# EAGLE board BSC_mini (EAGLE 7.7.0), part 1 of 3
DRAWING_NUMBER: V002; DRAWN: Mario Blunk / Blunk electronic; PROJECT: M-1; STATUS: DEVELOPMENT
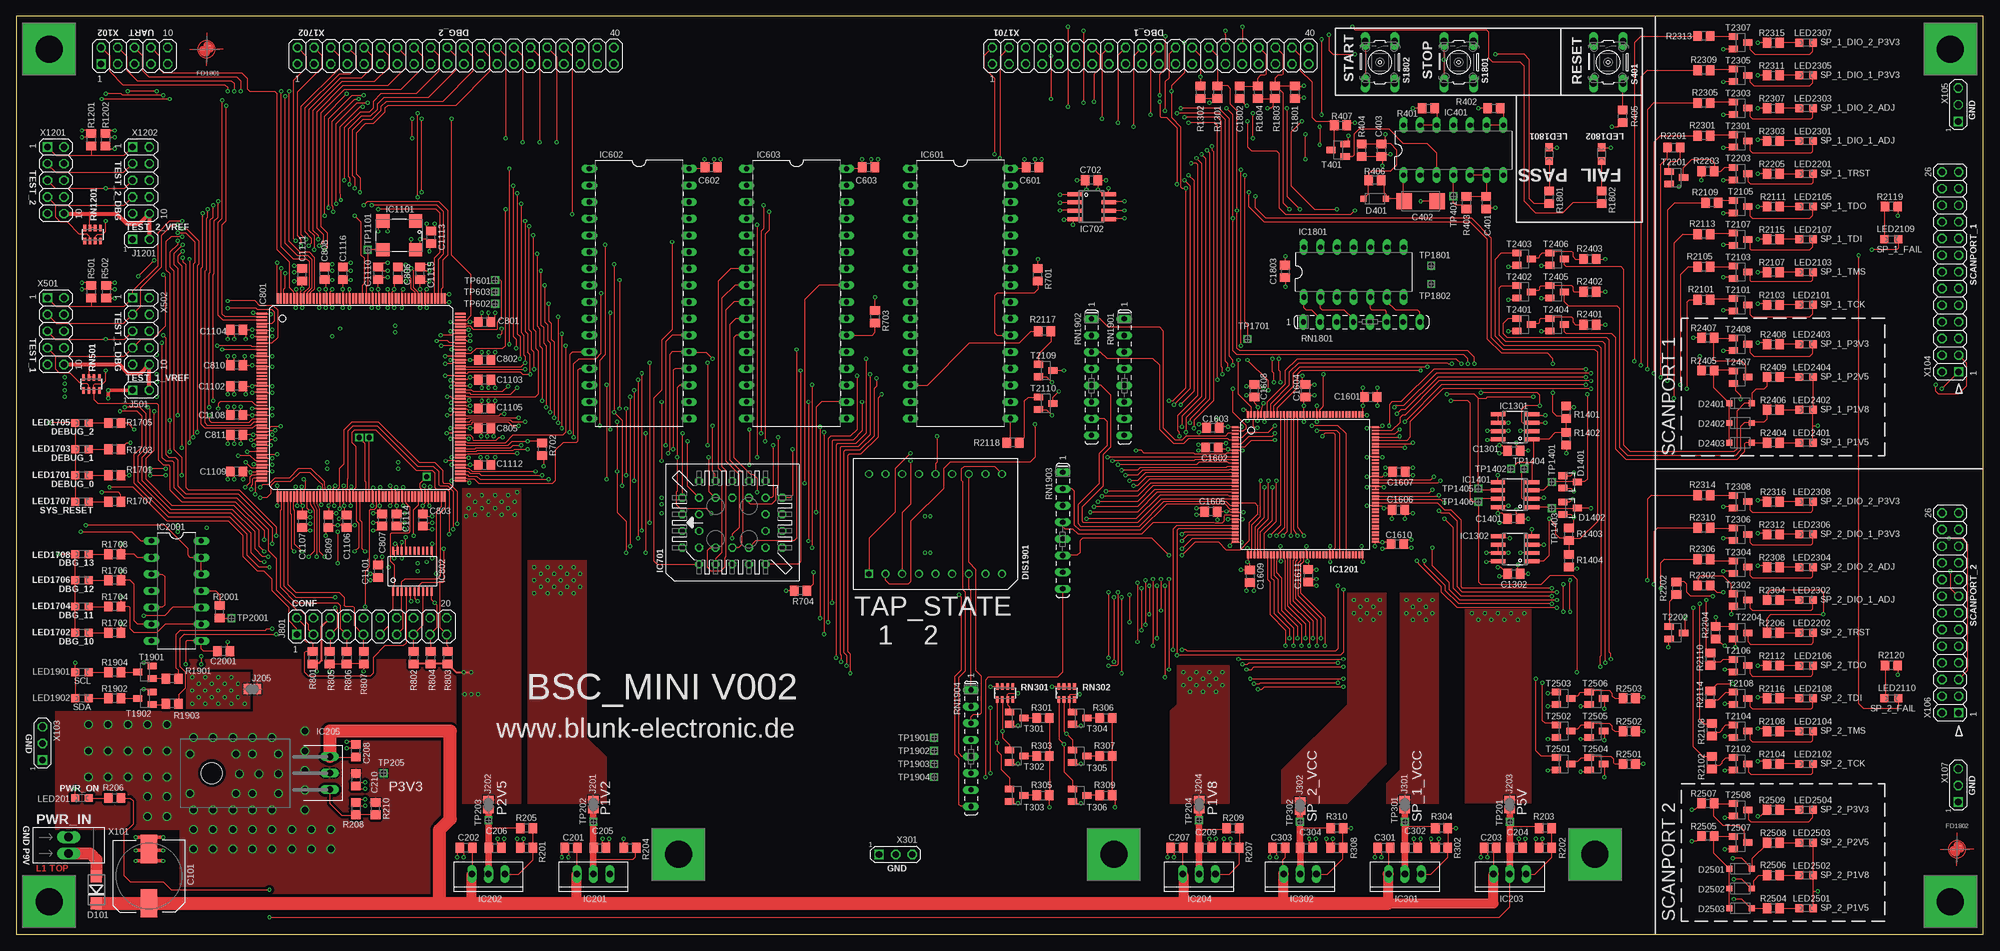
[diagram p25: board, top side]
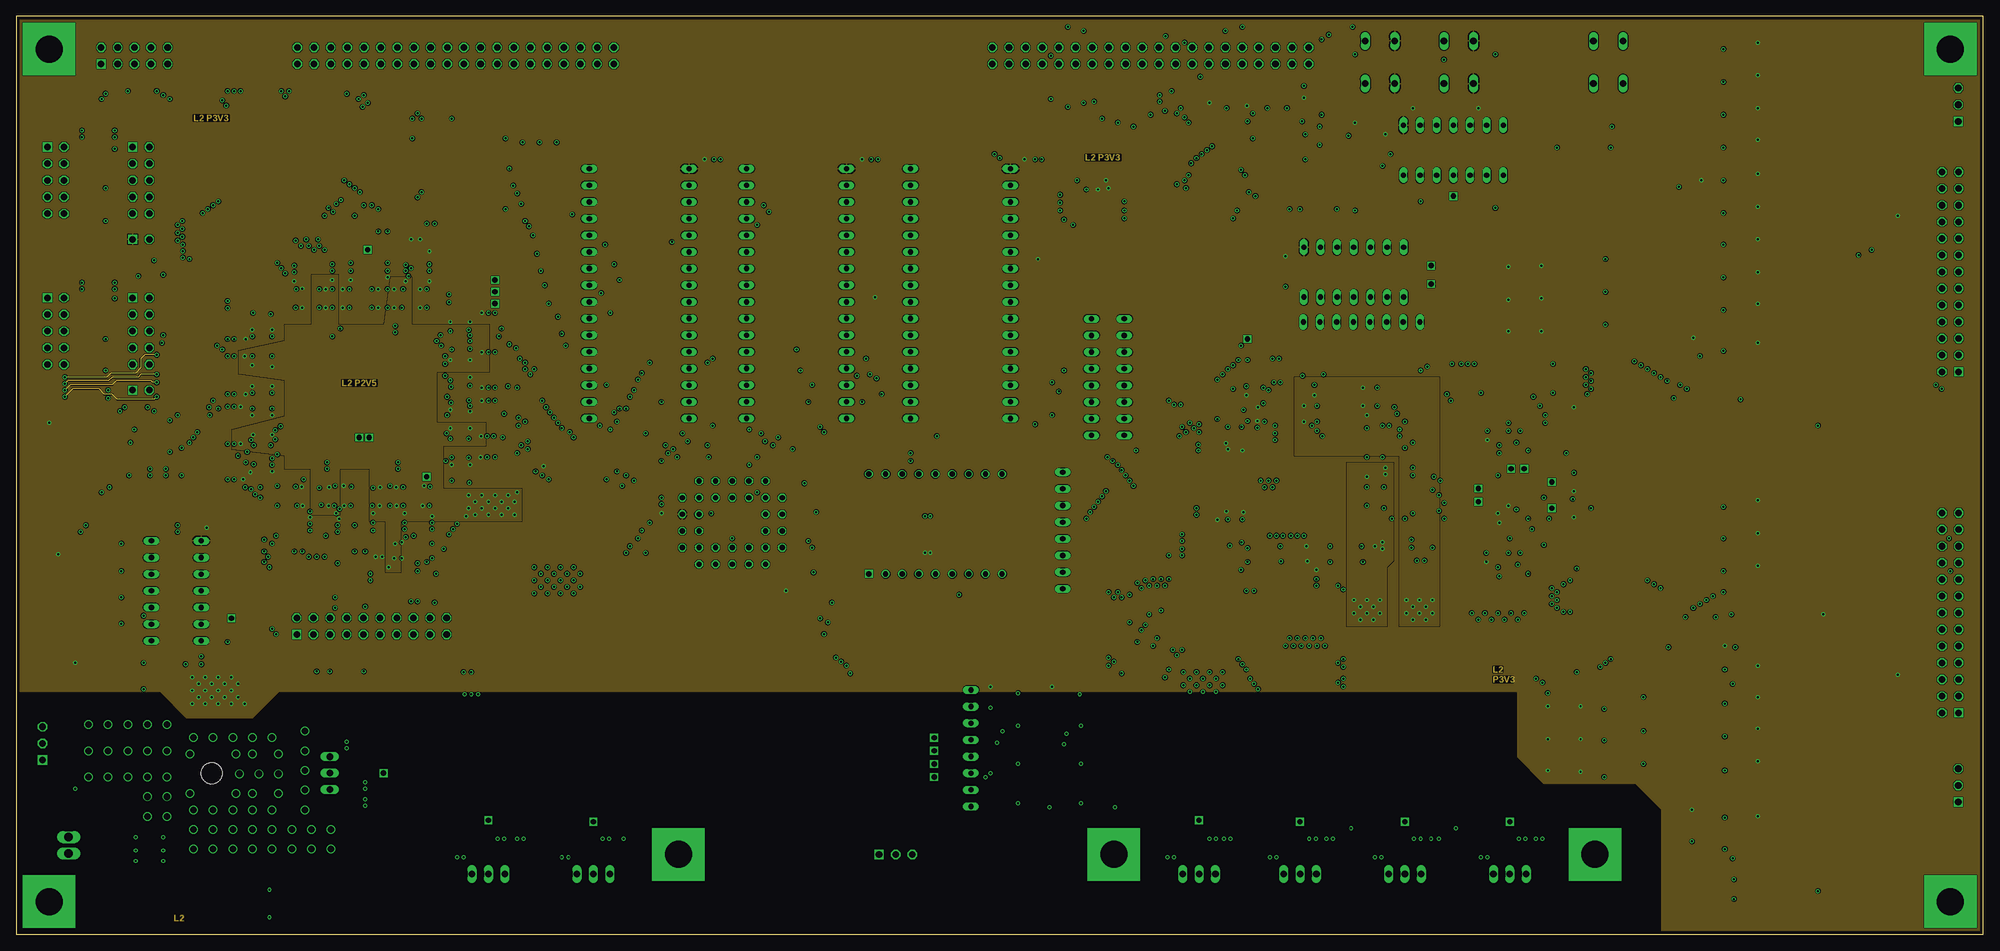
[diagram p26: board, inner layer Route2]
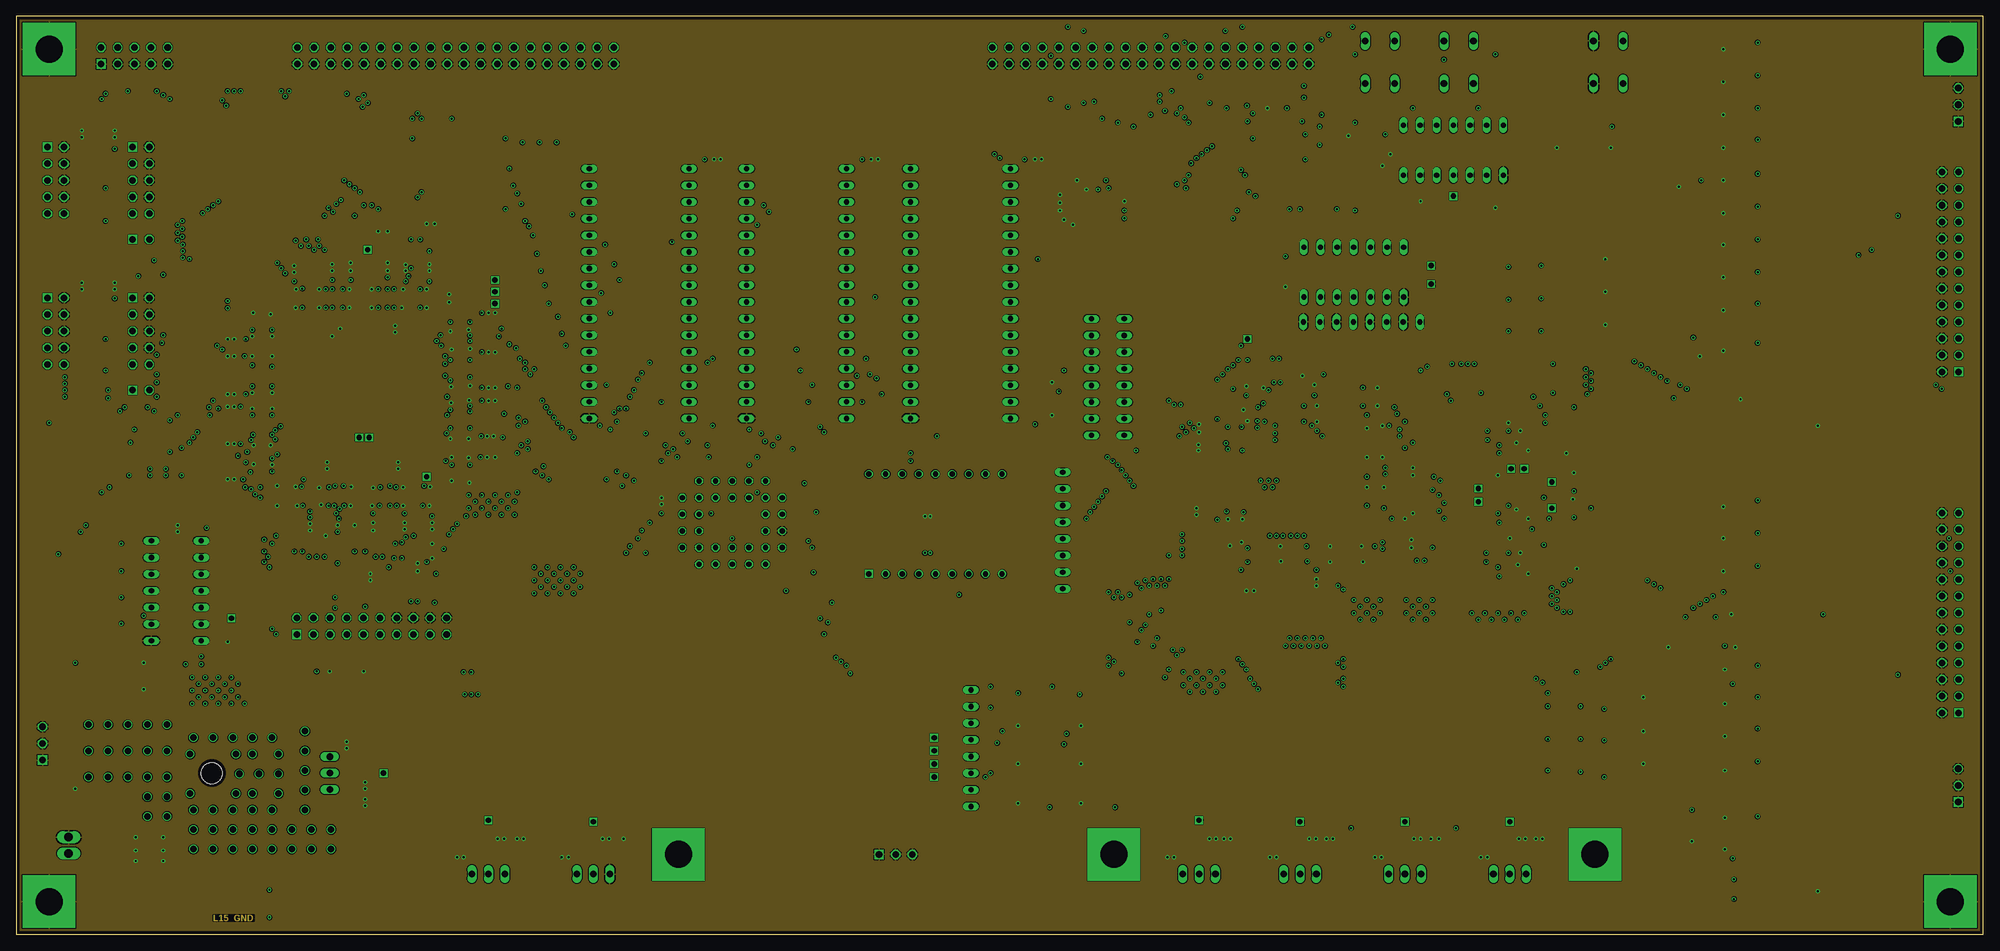
[diagram p27: board, inner layer Route15]
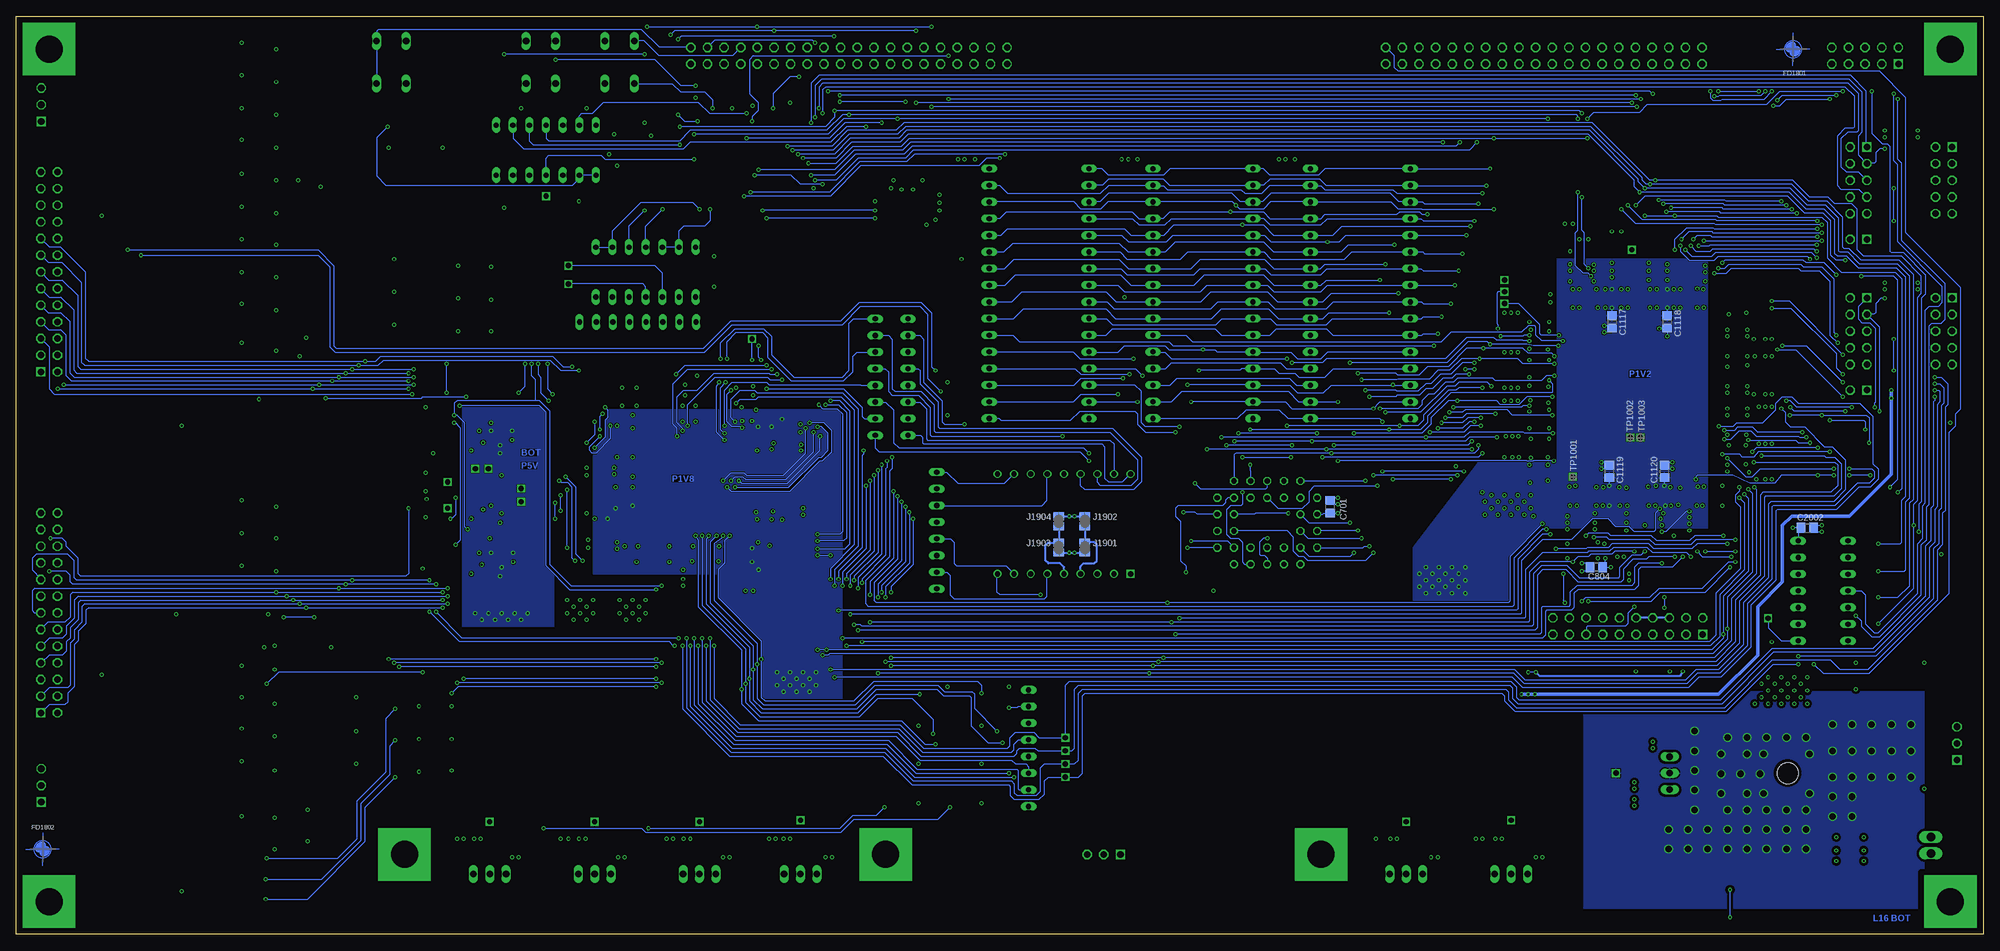
[diagram p28: board, bottom side, seen from below]

Size 300 x 140 mm. Coordinates in mm from the lower left corner, seen from the top.
Outline: 0,0 300,0 300,140 0,140 0,0
Copper layers (1+2*15+16): Top 0.035mm / dielectric 0.2mm / Route2 0.035mm / dielectric 1mm / Route15 0.035mm / dielectric 0.2mm / Bottom 0.035mm
Design rules "JLP_ML4_fine": minimum track width 0.125mm, minimum drill 0.2mm, track to track 0.125mm, track to pad 0.125mm, pad to pad 0.125mm, via to via 0.125mm, smd to smd 0.125mm, copper to edge 0.5mm, drill to drill 0.2mm, minimum pad ring 0.2mm, minimum via ring 0.15mm, stop-mask expansion 0.05mm, vias tented up to drill 0.3mm, thermal gap 0.2mm

## Footprints (pad centres in the part's own frame; a part is rotated, then mirrored left to right if it is on the bottom)
S_RADIAL_10MM = smd 4.3 x 2.5: + 4.15,0; - -4.15,0
S_0805 = smd 1.3 x 1.5: 1 -0.95,0; 2 0.95,0
S_6032 = smd 2.4 x 2.4: + -2.5,0; - 2.5,0
S_DO214AC = smd 1.8 x 1.7: A 2.05,0; C -2.05,0
S_SOD123 = smd 0.9 x 0.9: A 1.7,0; C -1.7,0
S_SOT23 = smd 1 x 1.4: 1 -0.95,-1.1; 2 0.95,-1.1; 3 0,1.1
T_VQEXX_2DIGIT = drill 0.8 square: 1 -10.16,-7.62 | drill 0.8: 2 -7.62,-7.62; 3 -5.08,-7.62; 4 -2.54,-7.62; 5 0,-7.62; 6 2.54,-7.62; 7 5.08,-7.62; 8 7.62,-7.62; 9 10.16,-7.62; 10 10.16,7.62; 11 7.62,7.62; 12 5.08,7.62; 13 2.54,7.62; 14 0,7.62; 15 -2.54,7.62; 16 -5.08,7.62; 17 -7.62,7.62; 18 -10.16,7.62
CROSSHAIR = smd 0.305 x 0.152: 1 0.5,0.5
4.1_PAD = drill 4.1 pad 8 square: H1 0,0
T_TO220-3_VERTICAL = drill 1 long: 1 -2.5,0; 2 0,0; 3 2.5,0
T_TO220-3_HORIZONTAL = drill 1 long: 1 -2.5,0; 2 0,0; 3 2.5,0 | hole 3.2: 0,18
T_NDIP14 = drill 0.8 long: 1 -7.62,-3.81; 2 -5.08,-3.81; 3 -2.54,-3.81; 4 0,-3.81; 5 2.54,-3.81; 6 5.08,-3.81; 7 7.62,-3.81; 8 7.62,3.81; 9 5.08,3.81; 10 2.54,3.81; 11 0,3.81; 12 -2.54,3.81; 13 -5.08,3.81; 14 -7.62,3.81
T_NDIP32 = drill 0.8 long: 1 -17.78,-7.62; 2 -15.24,-7.62; 3 -12.7,-7.62; 4 -10.16,-7.62; 5 -7.62,-7.62; 6 -5.08,-7.62; 7 -2.54,-7.62; 8 0,-7.62; 9 2.54,-7.62; 10 5.08,-7.62; 11 7.62,-7.62; 12 10.16,-7.62; 13 12.7,-7.62; 14 15.24,-7.62; 15 17.78,-7.62; 16 20.32,-7.62; 17 20.32,7.62; 18 17.78,7.62; 19 15.24,7.62; 20 12.7,7.62; 21 10.16,7.62; 22 7.62,7.62; 23 5.08,7.62; 24 2.54,7.62; 25 0,7.62; 26 -2.54,7.62; 27 -5.08,7.62; 28 -7.62,7.62; 29 -10.16,7.62; 30 -12.7,7.62; 31 -15.24,7.62; 32 -17.78,7.62
T_PLCC32 = drill 0.8: 1 1.27,5.08 | drill 0.8 octagon: 2 -1.27,7.62; 3 -1.27,5.08; 4 -3.81,7.62; 5 -6.35,5.08; 6 -3.81,5.08; 7 -6.35,2.54; 8 -3.81,2.54; 9 -6.35,0; 10 -3.81,0; 11 -6.35,-2.54; 12 -3.81,-2.54; 13 -6.35,-5.08; 14 -3.81,-7.62; 15 -3.81,-5.08; 16 -1.27,-7.62; 17 -1.27,-5.08; 18 1.27,-7.62; 19 1.27,-5.08; 20 3.81,-7.62; 21 6.35,-5.08; 22 3.81,-5.08; 23 6.35,-2.54; 24 3.81,-2.54; 25 6.35,0; 26 3.81,0; 27 6.35,2.54; 28 3.81,2.54; 29 6.35,5.08; 30 3.81,7.62; 31 3.81,5.08; 32 1.27,7.62
S_SOIC8 = smd 0.6 x 2.2: 1 -1.905,-2.6; 2 -0.635,-2.6; 3 0.635,-2.6; 4 1.905,-2.6; 5 1.905,2.6; 6 0.635,2.6; 7 -0.635,2.6; 8 -1.905,2.6
S_PQ208 = smd 1.6 x 0.3: 1 -15.1,12.75; 2 -15.1,12.25; 3 -15.1,11.75; 4 -15.1,11.25; 5 -15.1,10.75; 6 -15.1,10.25; 7 -15.1,9.75; 8 -15.1,9.25; 9 -15.1,8.75; 10 -15.1,8.25; 11 -15.1,7.75; 12 -15.1,7.25; 13 -15.1,6.75; 14 -15.1,6.25; 15 -15.1,5.75; 16 -15.1,5.25; 17 -15.1,4.75; 18 -15.1,4.25; 19 -15.1,3.75; 20 -15.1,3.25; 21 -15.1,2.75; 22 -15.1,2.25; 23 -15.1,1.75; 24 -15.1,1.25; 25 -15.1,0.75; 26 -15.1,0.25; 27 -15.1,-0.25; 28 -15.1,-0.75; 29 -15.1,-1.25; 30 -15.1,-1.75; 31 -15.1,-2.25; 32 -15.1,-2.75; 33 -15.1,-3.25; 34 -15.1,-3.75; 35 -15.1,-4.25; 36 -15.1,-4.75; 37 -15.1,-5.25; 38 -15.1,-5.75; 39 -15.1,-6.25; 40 -15.1,-6.75; 41 -15.1,-7.25; 42 -15.1,-7.75; 43 -15.1,-8.25; 44 -15.1,-8.75; 45 -15.1,-9.25; 46 -15.1,-9.75; 47 -15.1,-10.25; 48 -15.1,-10.75; 49 -15.1,-11.25; 50 -15.1,-11.75; 51 -15.1,-12.25; 52 -15.1,-12.75; 105 15.1,-12.75; 106 15.1,-12.25; 107 15.1,-11.75; 108 15.1,-11.25; 109 15.1,-10.75; 110 15.1,-10.25; 111 15.1,-9.75; 112 15.1,-9.25; 113 15.1,-8.75; 114 15.1,-8.25; 115 15.1,-7.75; 116 15.1,-7.25; 117 15.1,-6.75; 118 15.1,-6.25; 119 15.1,-5.75; 120 15.1,-5.25; 121 15.1,-4.75; 122 15.1,-4.25; 123 15.1,-3.75; 124 15.1,-3.25; 125 15.1,-2.75; 126 15.1,-2.25; 127 15.1,-1.75; 128 15.1,-1.25; 129 15.1,-0.75; 130 15.1,-0.25; 131 15.1,0.25; 132 15.1,0.75; 133 15.1,1.25; 134 15.1,1.75; 135 15.1,2.25; 136 15.1,2.75; 137 15.1,3.25; 138 15.1,3.75; 139 15.1,4.25; 140 15.1,4.75; 141 15.1,5.25; 142 15.1,5.75; 143 15.1,6.25; 144 15.1,6.75; 145 15.1,7.25; 146 15.1,7.75; 147 15.1,8.25; 148 15.1,8.75; 149 15.1,9.25; 150 15.1,9.75; 151 15.1,10.25; 152 15.1,10.75; 153 15.1,11.25; 154 15.1,11.75; 155 15.1,12.25; 156 15.1,12.75 | smd 0.3 x 1.6: 53 -12.75,-15.1; 54 -12.25,-15.1; 55 -11.75,-15.1; 56 -11.25,-15.1; 57 -10.75,-15.1; 58 -10.25,-15.1; 59 -9.75,-15.1; 60 -9.25,-15.1; 61 -8.75,-15.1; 62 -8.25,-15.1; 63 -7.75,-15.1; 64 -7.25,-15.1; 65 -6.75,-15.1; 66 -6.25,-15.1; 67 -5.75,-15.1; 68 -5.25,-15.1; 69 -4.75,-15.1; 70 -4.25,-15.1; 71 -3.75,-15.1; 72 -3.25,-15.1; 73 -2.75,-15.1; 74 -2.25,-15.1; 75 -1.75,-15.1; 76 -1.25,-15.1; 77 -0.75,-15.1; 78 -0.25,-15.1; 79 0.25,-15.1; 80 0.75,-15.1; 81 1.25,-15.1; 82 1.75,-15.1; 83 2.25,-15.1; 84 2.75,-15.1; 85 3.25,-15.1; 86 3.75,-15.1; 87 4.25,-15.1; 88 4.75,-15.1; 89 5.25,-15.1; 90 5.75,-15.1; 91 6.25,-15.1; 92 6.75,-15.1; 93 7.25,-15.1; 94 7.75,-15.1; 95 8.25,-15.1; 96 8.75,-15.1; 97 9.25,-15.1; 98 9.75,-15.1; 99 10.25,-15.1; 100 10.75,-15.1; 101 11.25,-15.1; 102 11.75,-15.1; 103 12.25,-15.1; 104 12.75,-15.1; 157 12.75,15.1; 158 12.25,15.1; 159 11.75,15.1; 160 11.25,15.1; 161 10.75,15.1; 162 10.25,15.1; 163 9.75,15.1; 164 9.25,15.1; 165 8.75,15.1; 166 8.25,15.1; 167 7.75,15.1; 168 7.25,15.1; 169 6.75,15.1; 170 6.25,15.1; 171 5.75,15.1; 172 5.25,15.1; 173 4.75,15.1; 174 4.25,15.1; 175 3.75,15.1; 176 3.25,15.1; 177 2.75,15.1; 178 2.25,15.1; 179 1.75,15.1; 180 1.25,15.1; 181 0.75,15.1; 182 0.25,15.1; 183 -0.25,15.1; 184 -0.75,15.1; 185 -1.25,15.1; 186 -1.75,15.1; 187 -2.25,15.1; 188 -2.75,15.1; 189 -3.25,15.1; 190 -3.75,15.1; 191 -4.25,15.1; 192 -4.75,15.1; 193 -5.25,15.1; 194 -5.75,15.1; 195 -6.25,15.1; 196 -6.75,15.1; 197 -7.25,15.1; 198 -7.75,15.1; 199 -8.25,15.1; 200 -8.75,15.1; 201 -9.25,15.1; 202 -9.75,15.1; 203 -10.25,15.1; 204 -10.75,15.1; 205 -11.25,15.1; 206 -11.75,15.1; 207 -12.25,15.1; 208 -12.75,15.1
S_TSSOP20 = smd 0.305 x 1.245: 1 -2.925,-3.102; 2 -2.275,-3.102; 3 -1.625,-3.102; 4 -0.975,-3.102; 5 -0.325,-3.102; 6 0.325,-3.102; 7 0.975,-3.102; 8 1.625,-3.102; 9 2.275,-3.102; 10 2.925,-3.102; 11 2.925,3.102; 12 2.275,3.102; 13 1.625,3.102; 14 0.975,3.102; 15 0.325,3.102; 16 -0.325,3.102; 17 -0.975,3.102; 18 -1.625,3.102; 19 -2.275,3.102; 20 -2.925,3.102
S_XO91 = smd 2 x 2: 1 -2.5,-2.2; 2 2.5,-2.2; 3 2.5,2.2; 4 -2.5,2.2
S_TQFP144 = smd 1 x 0.3: 1 -10.7,8.75; 2 -10.7,8.25; 3 -10.7,7.75; 4 -10.7,7.25; 5 -10.7,6.75; 6 -10.7,6.25; 7 -10.7,5.75; 8 -10.7,5.25; 9 -10.7,4.75; 10 -10.7,4.25; 11 -10.7,3.75; 12 -10.7,3.25; 13 -10.7,2.75; 14 -10.7,2.25; 15 -10.7,1.75; 16 -10.7,1.25; 17 -10.7,0.75; 18 -10.7,0.25; 19 -10.7,-0.25; 20 -10.7,-0.75; 21 -10.7,-1.25; 22 -10.7,-1.75; 23 -10.7,-2.25; 24 -10.7,-2.75; 25 -10.7,-3.25; 26 -10.7,-3.75; 27 -10.7,-4.25; 28 -10.7,-4.75; 29 -10.7,-5.25; 30 -10.7,-5.75; 31 -10.7,-6.25; 32 -10.7,-6.75; 33 -10.7,-7.25; 34 -10.7,-7.75; 35 -10.7,-8.25; 36 -10.7,-8.75; 73 10.7,-8.75; 74 10.7,-8.25; 75 10.7,-7.75; 76 10.7,-7.25; 77 10.7,-6.75; 78 10.7,-6.25; 79 10.7,-5.75; 80 10.7,-5.25; 81 10.7,-4.75; 82 10.7,-4.25; 83 10.7,-3.75; 84 10.7,-3.25; 85 10.7,-2.75; 86 10.7,-2.25; 87 10.7,-1.75; 88 10.7,-1.25; 89 10.7,-0.75; 90 10.7,-0.25; 91 10.7,0.25; 92 10.7,0.75; 93 10.7,1.25; 94 10.7,1.75; 95 10.7,2.25; 96 10.7,2.75; 97 10.7,3.25; 98 10.7,3.75; 99 10.7,4.25; 100 10.7,4.75; 101 10.7,5.25; 102 10.7,5.75; 103 10.7,6.25; 104 10.7,6.75; 105 10.7,7.25; 106 10.7,7.75; 107 10.7,8.25; 108 10.7,8.75 | smd 0.3 x 1: 37 -8.75,-10.7; 38 -8.25,-10.7; 39 -7.75,-10.7; 40 -7.25,-10.7; 41 -6.75,-10.7; 42 -6.25,-10.7; 43 -5.75,-10.7; 44 -5.25,-10.7; 45 -4.75,-10.7; 46 -4.25,-10.7; 47 -3.75,-10.7; 48 -3.25,-10.7; 49 -2.75,-10.7; 50 -2.25,-10.7; 51 -1.75,-10.7; 52 -1.25,-10.7; 53 -0.75,-10.7; 54 -0.25,-10.7; 55 0.25,-10.7; 56 0.75,-10.7; 57 1.25,-10.7; 58 1.75,-10.7; 59 2.25,-10.7; 60 2.75,-10.7; 61 3.25,-10.7; 62 3.75,-10.7; 63 4.25,-10.7; 64 4.75,-10.7; 65 5.25,-10.7; 66 5.75,-10.7; 67 6.25,-10.7; 68 6.75,-10.7; 69 7.25,-10.7; 70 7.75,-10.7; 71 8.25,-10.7; 72 8.75,-10.7; 109 8.75,10.7; 110 8.25,10.7; 111 7.75,10.7; 112 7.25,10.7; 113 6.75,10.7; 114 6.25,10.7; 115 5.75,10.7; 116 5.25,10.7; 117 4.75,10.7; 118 4.25,10.7; 119 3.75,10.7; 120 3.25,10.7; 121 2.75,10.7; 122 2.25,10.7; 123 1.75,10.7; 124 1.25,10.7; 125 0.75,10.7; 126 0.25,10.7; 127 -0.25,10.7; 128 -0.75,10.7; 129 -1.25,10.7; 130 -1.75,10.7; 131 -2.25,10.7; 132 -2.75,10.7; 133 -3.25,10.7; 134 -3.75,10.7; 135 -4.25,10.7; 136 -4.75,10.7; 137 -5.25,10.7; 138 -5.75,10.7; 139 -6.25,10.7; 140 -6.75,10.7; 141 -7.25,10.7; 142 -7.75,10.7; 143 -8.25,10.7; 144 -8.75,10.7
S_SO8 = smd 0.6 x 2.2: 1 -1.905,-2.6; 2 -0.635,-2.6; 3 0.635,-2.6; 4 1.905,-2.6; 5 1.905,2.6; 6 0.635,2.6; 7 -0.635,2.6; 8 -1.905,2.6
S_SOLDER_JUMPER_NARROW = smd 1.168 x 1.6: 1 -0.762,0; 2 0.762,0
T_MALE_2X1_VERTICAL_PITCH_2MM54 = drill 1 square: 1 0,-1.27 | drill 1 octagon: 2 0,1.27
T_MALE_2X10_VERTICAL_GRID_2.54MM = drill 1 square: 1 -11.43,-1.27 | drill 1 octagon: 2 -11.43,1.27; 3 -8.89,-1.27; 4 -8.89,1.27; 5 -6.35,-1.27; 6 -6.35,1.27; 7 -3.81,-1.27; 8 -3.81,1.27; 9 -1.27,-1.27; 10 -1.27,1.27; 11 1.27,-1.27; 12 1.27,1.27; 13 3.81,-1.27; 14 3.81,1.27; 15 6.35,-1.27; 16 6.35,1.27; 17 8.89,-1.27; 18 8.89,1.27; 19 11.43,-1.27; 20 11.43,1.27
S_0805' = smd 1.2 x 1.2: A 0,-1.05; C 0,1.05
S_1206_4X = smd 0.4 x 1: 1 -1.2,-1; 2 -0.4,-1; 3 0.4,-1; 4 1.2,-1; 5 1.2,1; 6 0.4,1; 7 -0.4,1; 8 -1.2,1
T_SIL8 = drill 0.8 long: 1 -8.89,0; 2 -6.35,0; 3 -3.81,0; 4 -1.27,0; 5 1.27,0; 6 3.81,0; 7 6.35,0; 8 8.89,0
T_PUSH_BUTTON_6X6 = drill 1 long: 1 -3.25,2.25; 2 -3.25,-2.25; 3 3.25,2.25; 4 3.25,-2.25
T_TEST_POINT_SMALL = drill 0.8 square: 1 0,0
T_WIRE_CLAMP_1X2_PITCH_2MM5 = drill 1.3 pad 1.8 long: 1 -1.25,-0.02; 2 1.25,-0.02
T_MALE_2X5_VERTICAL_PITCH_2MM54 = drill 1 square: 1 -5.08,-1.27 | drill 1 octagon: 2 -5.08,1.27; 3 -2.54,-1.27; 4 -2.54,1.27; 5 0,-1.27; 6 0,1.27; 7 2.54,-1.27; 8 2.54,1.27; 9 5.08,-1.27; 10 5.08,1.27
T_MALE_3X1_VERTICAL = drill 1.016 square: 1 0,3.81 | drill 1.016 octagon: 2 0,1.27; 3 0,-1.27
T_MALE_2X13_VERTICAL_PITCH_2MM54 = drill 1 square: 1 -15.2,-1.27 | drill 1 octagon: 2 -15.2,1.27; 3 -12.66,-1.27; 4 -12.66,1.27; 5 -10.12,-1.27; 6 -10.12,1.27; 7 -7.58,-1.27; 8 -7.58,1.27; 9 -5.04,-1.27; 10 -5.04,1.27; 11 -2.5,-1.27; 12 -2.5,1.27; 13 0.04,-1.27; 14 0.04,1.27; 15 2.58,-1.27; 16 2.58,1.27; 17 5.12,-1.27; 18 5.12,1.27; 19 7.66,-1.27; 20 7.66,1.27; 21 10.2,-1.27; 22 10.2,1.27; 23 12.74,-1.27; 24 12.74,1.27; 25 15.28,-1.27; 26 15.28,1.27
T_MALE_2X20_VERTICAL_GRID_2.54MM = drill 1 octagon: 1 -24.13,-1.27; 2 -24.13,1.27; 3 -21.59,-1.27; 4 -21.59,1.27; 5 -19.05,-1.27; 6 -19.05,1.27; 7 -16.51,-1.27; 8 -16.51,1.27; 9 -13.97,-1.27; 10 -13.97,1.27; 11 -11.43,-1.27; 12 -11.43,1.27; 13 -8.89,-1.27; 14 -8.89,1.27; 15 -6.35,-1.27; 16 -6.35,1.27; 17 -3.81,-1.27; 18 -3.81,1.27; 19 -1.27,-1.27; 20 -1.27,1.27; 21 1.27,-1.27; 22 1.27,1.27; 23 3.81,-1.27; 24 3.81,1.27; 25 6.35,-1.27; 26 6.35,1.27; 27 8.89,-1.27; 28 8.89,1.27; 29 11.43,-1.27; 30 11.43,1.27; 31 13.97,-1.27; 32 13.97,1.27; 33 16.51,-1.27; 34 16.51,1.27; 35 19.05,-1.27; 36 19.05,1.27; 37 21.59,-1.27; 38 21.59,1.27; 39 24.13,-1.27; 40 24.13,1.27

## Placement (x,y rotation side)
C101  100u  [S_RADIAL_10MM]  20.24,8.89 270 top
C201  100n  [S_0805]  84.6,13.2 180 top
C202  100n  [S_0805]  68.6,13.2 180 top
C203  100n  [S_0805]  224.8,13.2 180 top
C204  1u  [S_0805]  228.8,13.2 0 top
C205  1u  [S_0805]  89,13.2 0 top
C206  1u  [S_0805]  73,13.2 0 top
C207  100n  [S_0805]  177,13.2 180 top
C208  100n  [S_0805]  51.8,28 90 top
C209  1u  [S_0805]  181.4,13.2 0 top
C210  1u  [S_0805]  51.8,23.6 270 top
C301  100n  [S_0805]  208.6,13.2 180 top
C302  1u  [S_0805]  212.8,13.2 0 top
C303  100n  [S_0805]  192.6,13.2 180 top
C304  1u  [S_0805]  196.8,13.2 0 top
C401  1u  [S_0805]  224.2,111.6 270 top
C402  100u  [S_6032]  214.2,111.8 0 top
C403  100n  [S_0805]  208.2,119.6 270 top
C601  100n  [S_0805]  155,117 0 top
C602  100n  [S_0805]  106,117 0 top
C603  100n  [S_0805]  130,117 0 top
C701  100n  [S_0805]  99.6,65.2 90 bottom
C702  100n  [S_0805]  164,115 180 top
C801  100n  [S_0805]  71.44,93.39 0 top
C802  100n  [S_0805]  71.4,87.6 0 top
C803  100n  [S_0805]  62,63.2 270 top
C804  100n  [S_0805]  59,56 180 bottom
C805  100n  [S_0805]  71.4,77.2 0 top
C806  100n  [S_0805]  58.2,100.8 90 top
C807  100n  [S_0805]  55.8,63.2 270 top
C808  100n  [S_0805]  47,100.8 90 top
C809  100n  [S_0805]  47.6,63 270 top
C810  100n  [S_0805]  33.6,86.8 180 top
C811  100n  [S_0805]  33.6,76.2 180 top
C1101  100n  [S_0805]  55.2,55.4 270 top
C1102  100n  [S_0805]  33.6,83.6 180 top
C1103  100n  [S_0805]  71.4,84.6 0 top
C1104  100n  [S_0805]  33.6,92.2 180 top
C1105  100n  [S_0805]  71.4,80.2 0 top
C1106  100n  [S_0805]  50.4,63 270 top
C1107  100n  [S_0805]  43.6,63 270 top
C1108  100n  [S_0805]  33.6,79.21 180 top
C1109  100n  [S_0805]  33.6,70.6 180 top
C1110  100n  [S_0805]  55.2,100.8 90 top
C1111  100n  [S_0805]  43.6,100.6 90 top
C1112  100n  [S_0805]  71.4,71.6 0 top
C1113  100n  [S_0805]  63.26,106.32 90 top
C1114  100n  [S_0805]  58,63.2 270 top
C1115  100n  [S_0805]  61.6,100.8 90 top
C1116  100n  [S_0805]  49.8,100.8 90 top
C1117  100n  [S_0805]  56.6,93.4 270 bottom
C1118  100n  [S_0805]  48.2,93.4 270 bottom
C1119  100n  [S_0805]  57,70.6 90 bottom
C1120  100n  [S_0805]  48.6,70.6 90 bottom
C1301  100n  [S_0805]  228.44,73.74 0 top
C1302  100n  [S_0805]  228.4,55 0 top
C1401  100n  [S_0805]  228.4,63.4 180 top
C1601  100n  [S_0805]  206.58,81.95 0 top
C1602  100n  [S_0805]  182.37,74.25 180 top
C1603  100n  [S_0805]  182.52,77.25 180 top
C1604  100n  [S_0805]  196.65,82.93 90 top
C1605  100n  [S_0805]  182.22,64.45 180 top
C1606  100n  [S_0805]  210.83,64.75 0 top
C1607  100n  [S_0805]  210.88,70.55 0 top
C1608  100n  [S_0805]  188.85,82.93 90 top
C1609  100n  [S_0805]  188.15,54.62 270 top
C1610  100n  [S_0805]  210.63,59.55 0 top
C1611  100n  [S_0805]  197.05,54.72 270 top
C1801  100n  [S_0805]  195,128.4 270 top
C1802  100n  [S_0805]  186.6,128.4 270 top
C1803  100n  [S_0805]  193.5,101.1 270 top
C2001  1u  [S_0805]  31.6,43.2 0 top
C2002  100n  [S_0805]  26.8,62 0 bottom
D101  S1A  [S_DO214AC]  12.19,6.8 90 top
D401  1N4148  [S_SOD123]  207.2,112.2 0 top
D1401  BAT54S  [S_SOT23]  237,69 270 top
D1402  BAT54S  [S_SOT23]  237,65 270 top
D2401  1N4148  [S_SOD123]  263,81 0 top
D2402  1N4148  [S_SOD123]  263,78 0 top
D2403  1N4148  [S_SOD123]  263,75 0 top
D2501  1N4148  [S_SOD123]  263,10 0 top
D2502  1N4148  [S_SOD123]  263,7 0 top
D2503  1N4148  [S_SOD123]  263,4 0 top
DIS1901  VQE14  [T_VQEXX_2DIGIT]  140.2,62.6 0 top
FD1801  FIDUCIAL_CROSSHAIR  [CROSSHAIR]  29,135 0 top
FD1802  FIDUCIAL_CROSSHAIR  [CROSSHAIR]  296,13 0 top
H201  HOLE_4.1_PAD  [4.1_PAD]  101,12.2 0 top
H202  HOLE_4.1_PAD  [4.1_PAD]  167.4,12.2 0 top
H203  HOLE_4.1_PAD  [4.1_PAD]  240.8,12.2 0 top
H1801  HOLE_4.1_PAD  [4.1_PAD]  5,5 0 top
H1802  HOLE_4.1_PAD  [4.1_PAD]  295,5 0 top
H1803  HOLE_4.1_PAD  [4.1_PAD]  5,135 0 top
H1804  HOLE_4.1_PAD  [4.1_PAD]  295,135 0 top
IC201  LM1117T-ADJ  [T_TO220-3_VERTICAL]  88,9.2 180 top
IC202  LM1117T-ADJ  [T_TO220-3_VERTICAL]  72,9.2 180 top
IC203  LM1117T-ADJ  [T_TO220-3_VERTICAL]  227.8,9.2 180 top
IC204  LM1117T-ADJ  [T_TO220-3_VERTICAL]  180.4,9.2 180 top
IC205  LM1117T-ADJ  [T_TO220-3_HORIZONTAL]  47.8,24.6 90 top
IC301  LM1117T-ADJ  [T_TO220-3_VERTICAL]  211.8,9.2 180 top
IC302  LM1117T-ADJ  [T_TO220-3_VERTICAL]  195.8,9.2 180 top
IC401  4093N  [T_NDIP14]  219.2,119.6 0 top
IC601  AS6C4008-55PCN  [T_NDIP32]  144,99 270 top
IC602  AS6C4008-55PCN  [T_NDIP32]  95,99 270 top
IC603  AS6C4008-55PCN  [T_NDIP32]  119,99 270 top
IC701  AM29LV040B  [T_PLCC32]  109.2,62.8 90 top
IC702  24LC256-I/SN  [S_SOIC8]  164,111 270 top
IC801  XC3S400-4PQG208C  [S_PQ208]  52.59,81.91 0 top
IC802  XCF04SVOG20C  [S_TSSOP20]  60.4,55.4 0 top
IC1101  50MHz  [S_XO91]  58.4,106.6 180 top
IC1201  XC2C384-10TQG144C  [S_TQFP144]  196.6,68.6 0 top
IC1301  MAX517ACSA+  [S_SO8]  228.6,77.4 90 top
IC1302  MAX517ACSA+  [S_SO8]  228.6,58.8 90 top
IC1401  MAX962ESA+  [S_SO8]  228.58,67.08 90 top
IC1801  4093N  [T_NDIP14]  204,101 0 top
IC2001  4093N  [T_NDIP14]  24.4,52.4 270 top
J201  [S_SOLDER_JUMPER_NARROW]  88,19.8 90 top
J202  [S_SOLDER_JUMPER_NARROW]  72,19.8 90 top
J203  [S_SOLDER_JUMPER_NARROW]  227.8,19.8 90 top
J204  [S_SOLDER_JUMPER_NARROW]  180.4,19.8 90 top
J205  [S_SOLDER_JUMPER_NARROW]  36,37.4 180 top
J301  [S_SOLDER_JUMPER_NARROW]  211.8,19.8 90 top
J302  [S_SOLDER_JUMPER_NARROW]  195.8,19.6 90 top
J501  JUMPER_1X2-T-VERTICAL_GRID_2.54MM  [T_MALE_2X1_VERTICAL_PITCH_2MM54]  19,83 270 top
J801  JUMPER_2X10-T-VERTICAL  [T_MALE_2X10_VERTICAL_GRID_2.54MM]  54.2,47 0 top
J1201  JUMPER_1X2-T-VERTICAL_GRID_2.54MM  [T_MALE_2X1_VERTICAL_PITCH_2MM54]  19,106 270 top
J1901  [S_SOLDER_JUMPER_NARROW]  137,59 90 bottom
J1902  [S_SOLDER_JUMPER_NARROW]  137,63 270 bottom
J1903  [S_SOLDER_JUMPER_NARROW]  141,59 270 bottom
J1904  [S_SOLDER_JUMPER_NARROW]  141,63 90 bottom
LED201  green  [S_0805']  10,20.8 90 top
LED1701  green  [S_0805']  10,70 270 top
LED1702  green  [S_0805']  10,46 270 top
LED1703  yellow  [S_0805']  10,74 270 top
LED1704  yellow  [S_0805']  10,50 270 top
LED1705  blue  [S_0805']  10,78 270 top
LED1706  red  [S_0805']  10,54 270 top
LED1707  red  [S_0805']  10,66 270 top
LED1708  blue  [S_0805']  10,58 270 top
LED1801  green  [S_0805']  233.8,119 0 top
LED1802  red  [S_0805']  241.8,119 0 top
LED1901  yellow  [S_0805']  10,40 270 top
LED1902  blue  [S_0805']  10,36 270 top
LED2101  yellow  [S_0805']  273,96 270 top
LED2102  yellow  [S_0805']  273,26 270 top
LED2103  blue  [S_0805']  273,101 270 top
LED2104  blue  [S_0805']  273,31 270 top
LED2105  green  [S_0805']  273,111 270 top
LED2106  green  [S_0805']  273,41 270 top
LED2107  green  [S_0805']  273,106 270 top
LED2108  green  [S_0805']  273,36 270 top
LED2109  red  [S_0805']  286,106 270 top
LED2110  red  [S_0805']  286,36 270 top
LED2201  red  [S_0805']  273,116 270 top
LED2202  red  [S_0805']  273,46 270 top
LED2301  green  [S_0805']  273,121 270 top
LED2302  green  [S_0805']  273,51 270 top
LED2303  green  [S_0805']  273,126 270 top
LED2304  green  [S_0805']  273,56 270 top
LED2305  green  [S_0805']  273,131 270 top
LED2306  green  [S_0805']  273,61 270 top
LED2307  green  [S_0805']  273,136 270 top
LED2308  green  [S_0805']  273,66 270 top
LED2401  blue  [S_0805']  273,75 270 top
LED2402  green  [S_0805']  273,80 270 top
LED2403  yellow  [S_0805']  273,90 270 top
LED2404  green  [S_0805']  273,85 270 top
LED2501  blue  [S_0805']  273,4 270 top
LED2502  green  [S_0805']  273,9 270 top
LED2503  green  [S_0805']  273,14 270 top
LED2504  yellow  [S_0805']  273,19 270 top
R201  240  [S_0805]  77.8,13.2 0 top
R202  715  [S_0805]  233.2,13.2 0 top
R203  240  [S_0805]  233.2,16.2 180 top
R204  240  [S_0805]  93.6,13.2 0 top
R205  240  [S_0805]  77.8,16.2 180 top
R206  330  [S_0805]  15,20.8 0 top
R207  105  [S_0805]  185.6,13.2 0 top
R208  392  [S_0805]  51.8,19.2 270 top
R209  240  [S_0805]  185.6,16.2 180 top
R210  240  [S_0805]  54.8,19.2 90 top
R301  71R5  [S_0805]  156.6,33 0 top
R302  392  [S_0805]  217.4,13.2 0 top
R303  169  [S_0805]  156.6,27.2 0 top
R304  240  [S_0805]  217.4,16.2 180 top
R305  698  [S_0805]  156.6,21.2 0 top
R306  71R5  [S_0805]  166.2,33 0 top
R307  169  [S_0805]  166.2,27.2 0 top
R308  392  [S_0805]  201.4,13.2 0 top
R309  698  [S_0805]  166.2,21.2 0 top
R310  240  [S_0805]  201.4,16.2 180 top
R401  1M  [S_0805]  215.4,126 0 top
R402  1M  [S_0805]  225.4,126 0 top
R403  1M  [S_0805]  221.2,111.6 90 top
R404  1k5  [S_0805]  205.2,119.6 90 top
R405  33  [S_0805]  245,124.8 90 top
R406  27k  [S_0805]  207.2,115 180 top
R407  1k5  [S_0805]  202,123.4 0 top
R501  330  [S_0805]  11.4,98 270 top
R502  330  [S_0805]  13.69,98 270 top
R701  330  [S_0805]  155.8,100.6 90 top
R702  330  [S_0805]  80.2,74 270 top
R703  330  [S_0805]  131,94.2 90 top
R704  330  [S_0805]  119.6,52.4 180 top
R801  4k7  [S_0805]  45.2,42.2 270 top
R802  4k7  [S_0805]  60.6,42.2 270 top
R803  4k7  [S_0805]  65.8,42.2 270 top
R804  330  [S_0805]  63.2,42.2 270 top
R805  330  [S_0805]  47.8,42.2 270 top
R806  330  [S_0805]  50.4,42.2 270 top
R807  330  [S_0805]  53,42.2 270 top
R1201  330  [S_0805]  11.4,121.2 270 top
R1202  330  [S_0805]  13.6,121.2 270 top
R1301  330  [S_0805]  183.2,128.4 270 top
R1302  330  [S_0805]  180.6,128.4 270 top
R1401  8k2  [S_0805]  236.4,79.6 90 top
R1402  2k7  [S_0805]  236.4,75.6 90 top
R1403  8k2  [S_0805]  236.8,61 90 top
R1404  2k7  [S_0805]  236.8,57 90 top
R1701  160  [S_0805]  15,70 180 top
R1702  160  [S_0805]  15,46 180 top
R1703  470  [S_0805]  15,74 180 top
R1704  470  [S_0805]  15,50 180 top
R1705  330  [S_0805]  15,78 180 top
R1706  750  [S_0805]  15,54 180 top
R1707  750  [S_0805]  15,66 180 top
R1708  330  [S_0805]  15,58 180 top
R1801  160  [S_0805]  233.8,112.4 90 top
R1802  750  [S_0805]  241.8,112.4 90 top
R1803  1M  [S_0805]  192,128.4 270 top
R1804  1M  [S_0805]  189.4,128.4 270 top
R1901  100k  [S_0805]  23.8,39 180 top
R1902  470  [S_0805]  15,40 180 top
R1903  100k  [S_0805]  23.8,35.2 180 top
R1904  330  [S_0805]  15,36 180 top
R2001  1M  [S_0805]  31,49.2 90 top
R2101  100k  [S_0805]  257.4,96.8 180 top
R2102  100k  [S_0805]  258.6,26.2 90 top
R2103  470  [S_0805]  268,96 0 top
R2104  470  [S_0805]  268,26 0 top
R2105  100k  [S_0805]  257.4,101.8 180 top
R2106  100k  [S_0805]  258.6,31.2 90 top
R2107  330  [S_0805]  268,101 180 top
R2108  330  [S_0805]  268,31 180 top
R2109  100k  [S_0805]  258.6,111.6 180 top
R2110  100k  [S_0805]  258.4,42 90 top
R2111  160  [S_0805]  268,111 0 top
R2112  160  [S_0805]  268,41 0 top
R2113  100k  [S_0805]  257.4,106.8 180 top
R2114  100k  [S_0805]  258.4,36.2 90 top
R2115  160  [S_0805]  268,106 0 top
R2116  160  [S_0805]  268,36 0 top
R2117  100k  [S_0805]  156.8,92 180 top
R2118  100k  [S_0805]  152,75 180 top
R2119  750  [S_0805]  286,111 180 top
R2120  750  [S_0805]  286,41 180 top
R2201  100k  [S_0805]  252.8,120 0 top
R2202  100k  [S_0805]  253.2,52.8 270 top
R2203  2k7  [S_0805]  258,116.4 0 top
R2204  2k7  [S_0805]  259.2,46 90 top
R2205  750  [S_0805]  268,116 0 top
R2206  750  [S_0805]  268,46 0 top
R2301  100k  [S_0805]  257.4,121.8 180 top
R2302  100k  [S_0805]  257.4,53.2 0 top
R2303  160  [S_0805]  268,121 0 top
R2304  160  [S_0805]  268,51 0 top
R2305  100k  [S_0805]  257.4,126.8 180 top
R2306  100k  [S_0805]  257.4,57.2 180 top
R2307  160  [S_0805]  268,126 0 top
R2308  160  [S_0805]  268,56 0 top
R2309  100k  [S_0805]  257.4,131.8 180 top
R2310  100k  [S_0805]  257.4,62 180 top
R2311  160  [S_0805]  268,131 0 top
R2312  160  [S_0805]  268,61 0 top
R2313  100k  [S_0805]  257.4,137 180 top
R2314  100k  [S_0805]  257.4,67 180 top
R2315  160  [S_0805]  268,136 0 top
R2316  160  [S_0805]  268,66 0 top
R2401  2k7  [S_0805]  240,93 0 top
R2402  2k7  [S_0805]  240,98 0 top
R2403  2k7  [S_0805]  240,103 0 top
R2404  330  [S_0805]  268,75 180 top
R2405  2k7  [S_0805]  258,86 180 top
R2406  160  [S_0805]  268,80 0 top
R2407  2k7  [S_0805]  258,91 0 top
R2408  470  [S_0805]  268,90 0 top
R2409  160  [S_0805]  268,85 0 top
R2501  2k7  [S_0805]  246,26 0 top
R2502  2k7  [S_0805]  246,31 0 top
R2503  2k7  [S_0805]  246,36 0 top
R2504  330  [S_0805]  268,4 180 top
R2505  2k7  [S_0805]  258,15 180 top
R2506  160  [S_0805]  268,9 0 top
R2507  2k7  [S_0805]  258,20 0 top
R2508  160  [S_0805]  268,14 0 top
R2509  470  [S_0805]  268,19 0 top
RN301  10k  [S_1206_4X]  150.8,36.8 0 top
RN302  10k  [S_1206_4X]  160.2,36.8 0 top
RN501  10k  [S_1206_4X]  11.45,83.94 0 top
RN1201  10k  [S_1206_4X]  11.63,106.74 0 top
RN1801  100  [T_SIL8]  205.2,93.4 0 top
RN1901  100  [T_SIL8]  169,85 270 top
RN1902  100  [T_SIL8]  164,85 270 top
RN1903  100  [T_SIL8]  159.6,61.6 270 top
RN1904  100  [T_SIL8]  145.6,28.4 270 top
S401  [T_PUSH_BUTTON_6X6]  242.8,133 270 top
S1801  [T_PUSH_BUTTON_6X6]  220,133 270 top
S1802  [T_PUSH_BUTTON_6X6]  208,133 270 top
T301  DMG3420U  [S_SOT23]  152.6,33 270 top
T302  DMG3420U  [S_SOT23]  152.6,27.2 270 top
T303  DMG3420U  [S_SOT23]  152.6,21.2 270 top
T304  DMG3420U  [S_SOT23]  162.2,33 270 top
T305  DMG3420U  [S_SOT23]  162.2,27.2 270 top
T306  DMG3420U  [S_SOT23]  162.2,21.2 270 top
T401  DMG3420U  [S_SOT23]  201.6,119.6 90 top
T1901  DMG3420U  [S_SOT23]  19.6,40 90 top
T1902  DMG3420U  [S_SOT23]  19.6,36 90 top
T2101  DMG3420U  [S_SOT23]  263,96 270 top
T2102  DMG3420U  [S_SOT23]  263,26 270 top
T2103  DMG3420U  [S_SOT23]  263,101 270 top
T2104  DMG3420U  [S_SOT23]  263,31 270 top
T2105  DMG3420U  [S_SOT23]  263,111 270 top
T2106  DMG3420U  [S_SOT23]  263,41 270 top
T2107  DMG3420U  [S_SOT23]  263,106 270 top
T2108  DMG3420U  [S_SOT23]  263,36 270 top
T2109  DMG3420U  [S_SOT23]  157,86 270 top
T2110  DMG3420U  [S_SOT23]  157,81 270 top
T2201  DMG3420U  [S_SOT23]  253.2,115.4 270 top
T2202  DMG3420U  [S_SOT23]  253.2,46 270 top
T2203  DMG3420U  [S_SOT23]  263,116 270 top
T2204  DMG3420U  [S_SOT23]  263,46 270 top
T2301  DMG3420U  [S_SOT23]  263,121 270 top
T2302  DMG3420U  [S_SOT23]  263,51 270 top
T2303  DMG3420U  [S_SOT23]  263,126 270 top
T2304  DMG3420U  [S_SOT23]  263,56 270 top
T2305  DMG3420U  [S_SOT23]  263,131 270 top
T2306  DMG3420U  [S_SOT23]  263,61 270 top
T2307  DMG3420U  [S_SOT23]  263,136 270 top
T2308  DMG3420U  [S_SOT23]  263,66 270 top
T2401  NX2301P  [S_SOT23]  230,93 270 top
T2402  NX2301P  [S_SOT23]  230,98 270 top
T2403  NX2301P  [S_SOT23]  230,103 270 top
T2404  NX2301P  [S_SOT23]  235,93 270 top
T2405  NX2301P  [S_SOT23]  235,98 270 top
T2406  NX2301P  [S_SOT23]  235,103 270 top
T2407  DMG3420U  [S_SOT23]  263,85 270 top
T2408  DMG3420U  [S_SOT23]  263,90 270 top
T2501  NX2301P  [S_SOT23]  236,26 270 top
T2502  NX2301P  [S_SOT23]  236,31 270 top
T2503  NX2301P  [S_SOT23]  236,36 270 top
T2504  NX2301P  [S_SOT23]  241,26 270 top
T2505  NX2301P  [S_SOT23]  241,31 270 top
T2506  NX2301P  [S_SOT23]  241,36 270 top
T2507  DMG3420U  [S_SOT23]  263,14 270 top
T2508  DMG3420U  [S_SOT23]  263,19 270 top
TP201  [T_TEST_POINT_SMALL]  227.8,17.2 0 top
TP202  +1V2  [T_TEST_POINT_SMALL]  88,17.2 0 top
TP203  +2V5  [T_TEST_POINT_SMALL]  72,17.4 0 top
TP204  [T_TEST_POINT_SMALL]  180.4,17.4 0 top
TP205  +2V5  [T_TEST_POINT_SMALL]  56,24.6 270 top
TP301  [T_TEST_POINT_SMALL]  211.8,17.2 0 top
TP302  [T_TEST_POINT_SMALL]  195.8,17.2 0 top
TP401  clk_slow  [T_TEST_POINT_SMALL]  219.2,112.6 0 top
TP601  [T_TEST_POINT_SMALL]  73,99.8 0 top
TP602  [T_TEST_POINT_SMALL]  73,96.2 0 top
TP603  [T_TEST_POINT_SMALL]  73,98 0 top
TP1001  [T_TEST_POINT_SMALL]  62.57,69.78 0 bottom
TP1002  [T_TEST_POINT_SMALL]  53.82,75.78 0 bottom
TP1003  [T_TEST_POINT_SMALL]  52.27,75.78 0 bottom
TP1101  [T_TEST_POINT_SMALL]  53.6,104.4 0 top
TP1401  [T_TEST_POINT_SMALL]  234.2,69 90 top
TP1402  [T_TEST_POINT_SMALL]  228,71 90 top
TP1403  [T_TEST_POINT_SMALL]  234.2,65 90 top
TP1404  [T_TEST_POINT_SMALL]  230,71 90 top
TP1405  [T_TEST_POINT_SMALL]  223,68 90 top
TP1406  [T_TEST_POINT_SMALL]  223,66 90 top
TP1701  [T_TEST_POINT_SMALL]  187.8,90.8 0 top
TP1801  [T_TEST_POINT_SMALL]  215.8,102 0 top
TP1802  [T_TEST_POINT_SMALL]  215.8,99.2 0 top
TP1901  [T_TEST_POINT_SMALL]  140,30 270 top
TP1902  [T_TEST_POINT_SMALL]  140,28 270 top
TP1903  [T_TEST_POINT_SMALL]  140,26 270 top
TP1904  [T_TEST_POINT_SMALL]  140,24 270 top
TP2001  clk_slow  [T_TEST_POINT_SMALL]  32.8,48.2 0 top
U$40  [A3_LANDSCAPE]  -106,-134 0 top  (outside the outline)
X101  CLAMP_1X2-T-2.5MM  [T_WIRE_CLAMP_1X2_PITCH_2MM5]  8,13.6 270 top
X102  MALE_2X5-T-VERTICAL_2MM54  [T_MALE_2X5_VERTICAL_PITCH_2MM54]  18,134 0 top
X103  MALE_1X3  [T_MALE_3X1_VERTICAL]  4,30.4 180 top
X104  MALE_2X13-T-VERTICAL_PITCH_2MM54  [T_MALE_2X13_VERTICAL_PITCH_2MM54]  295,101 90 top
X105  MALE_1X3  [T_MALE_3X1_VERTICAL]  296.2,127.8 180 top
X106  MALE_2X13-T-VERTICAL_PITCH_2MM54  [T_MALE_2X13_VERTICAL_PITCH_2MM54]  295,49 90 top
X107  MALE_1X3  [T_MALE_3X1_VERTICAL]  296.2,24 180 top
X301  MALE_1X3  [T_MALE_3X1_VERTICAL]  135.4,12.2 90 top
X501  MALE_2X5-T-VERTICAL_2MM54  [T_MALE_2X5_VERTICAL_PITCH_2MM54]  6,92 270 top
X502  MALE_2X5-T-VERTICAL_2MM54  [T_MALE_2X5_VERTICAL_PITCH_2MM54]  19,92 270 top
X1201  MALE_2X5-T-VERTICAL_2MM54  [T_MALE_2X5_VERTICAL_PITCH_2MM54]  6,115 270 top
X1202  MALE_2X5-T-VERTICAL_2MM54  [T_MALE_2X5_VERTICAL_PITCH_2MM54]  19,115 270 top
X1701  [T_MALE_2X20_VERTICAL_GRID_2.54MM]  173,134 0 top
X1702  [T_MALE_2X20_VERTICAL_GRID_2.54MM]  67,134 0 top

## Tracks (layer width: path | path; a pad name or v marks a point on that pad's centre or on a via)
ACL_IN
  Top 0.15: IC2001.11 30.4,52.4 31,51.8 R2001.2
ACL_OUT  (via drill 0.3)
  Top 0.15: IC2001.10 23.86,49.86 22.6,48.6 v19.4,48.6 | IC801.2 31.84,94.16 31.4,94.6 31.4,108.2 32,108.8 v32,126.4 | v23.4,127.4 v13,127.4
  Bottom 0.15: v19.4,48.6 18.6,47.8 18.6,47 17,45.4 15.8,45.4 9.4,51.8 9.4,59.4 8.6,60.2 8.6,65.2 8.2,65.6 8.2,92.8 7.8,93.2 6.4,93.2 5.8,93.8 5.8,99.2 12.4,105.8 12.4,117.6 13,118.2 v13,127.4 | v32,126.4 31,126.4 30,127.4 v23.4,127.4
ACL_RC  (via drill 0.3)
  Top 0.15: R2001.1 32.75,48.25 TP2001.1 | C2001.1 28.6,43.2 28.2,43.6 IC2001.8 28.19,44.8 26,44.8 25.8,44.6 v25.8,41.2
  Bottom 0.15: TP2001.1 32.8,46.8 30.8,44.8 28.23,44.8 IC2001.8 | v25.8,41.2 24.4,39.8 17.4,39.8 5.2,52 5.2,76.6 4.2,77.6 4.2,79.4 3.4,80.2 3.4,98.6 11.8,107 11.8,127.6 15.8,131.6 89.2,131.6 89.8,132.2 89.8,134 91.07,135.27 X1702.40
CLK_MASTER
  Top 0.15: IC1101.3 TP1101.1 53.6,99 53.34,98.74 IC801.181
CLK_SLOW  (via drill 0.3)
  Top 0.15: R403.1 220.65,111.2 219.6,111.2 219.2,111.6 TP401.1 IC401.4 | IC801.154 67.73,93.7 68.7,93.7 69.4,94.4 69.4,100.6 66.4,103.6 v66.4,124.4 | X1701.16 165.6,134.22 v165.6,124.4 | v196.6,118.2 v196.6,122
  Bottom 0.15: v66.4,124.4 v165.6,124.4 173.8,124.4 176.2,122 v196.6,122 | IC401.4 219.2,118.4 218.8,118.8 210.8,118.8 210.2,118.2 v196.6,118.2
CONF_CCLK
  Top 0.15: J801.13 59,46.72 59,49.2 58.77,49.42 IC802.3 58.8,52.32 58.8,53.8 59.2,54.2 64.2,54.2 64.6,54.6 64.6,64.2 65.4,65 65.4,66.75 IC801.104
CONF_DIN
  Top 0.15: J801.11 56.8,47.06 56.8,49 57.48,49.67 IC802.1 57.48,53.12 57.6,53.4 57.6,56.4 57,57 57,61 57.2,61.2 59.8,61.2 60,61.4 60,65.2 59.4,65.8 59.4,66.75 IC801.92
CONF_DONE  (via drill 0.3)
  Top 0.15: R804.1 63.2,44.4 63.09,44.51 J801.17 64.2,46.84 64.2,50.2 v63.8,50.6 63.33,51.08 IC802.10 | IC801.103 64.8,66.77 64.8,65.2 64,64.4 v64,55
  Bottom 0.15: v64,55 64,51 v63.8,50.6
CONF_DOUT
  Top 0.15: IC801.81 53.84,69.56 53.8,69.6 53.8,75.76 TP1002.1
CONF_HSW_EN  (via drill 0.3)
  Top 0.15: J801.3 44.6,46.44 44.6,47.2 44.2,47.6 44.2,48.6 43.4,49.4 42.8,49.4 39.6,52.6 39.6,57.4 38.4,58.6 38.4,61.8 33.6,66.6 25.6,66.6 24,68.2 24,72 23.8,72.2 22.8,72.2 22.2,72.8 v22.2,90.2 | IC801.206 40.8,97.05 40.8,98.4 41,98.6 v41,100.8
  Bottom 0.15: v41,100.8 39.2,100.8 38.4,101.6 28.2,101.6 27.8,101.2 25,101.2 23.4,99.6 23.4,91.4 v22.2,90.2
CONF_INIT_B  (via drill 0.3)
  Top 0.15: R802.1 60.55,43.2 J801.15 62.02,47.2 IC802.8 | IC801.83 54.85,66.75 54.85,65.1 54.55,64.8 54,64.8 53.8,64.6 53.8,56 53.2,55.4 v53.2,50
  Bottom 0.15: v53.2,50 54.2,49 54.2,47.4 54.6,47 60.4,47 60.55,46.85 J801.15
CONF_M0  (via drill 0.3)
  Top 0.15: R805.1 47.85,43.2 J801.5 49,46.88 49,49.4 v48.6,49.8 | IC801.55 40.8,66.77 40.8,53.2 42.6,51.4 v48.6,51.4
  Bottom 0.15: v48.6,51.4 v48.6,49.8
CONF_M1
  Top 0.15: R806.1 J801.7 49.4,46.72 49.4,50.2 49,50.6 42.6,50.6 40.2,53 40.2,64.6 40.4,64.8 40.4,66.75 IC801.54
CONF_M2
  Top 0.15: R807.1 52.93,43.22 J801.9 51.6,47.06 51.6,49.8 51.4,50 50.2,50 50,50.2 50,51.4 49.2,52.2 42.6,52.2 41.4,53.4 41.4,66.75 IC801.56
CONF_PROG_B  (via drill 0.3)
  Top 0.15: R803.1 65.8,44 65.6,44.2 65.6,45.7 J801.19 64.6,46.76 64.6,53.6 | 64.6,53.6 65,53.6 65.2,53.8 v65.2,58.8 | 64.6,53.6 61.8,53.6 61.38,53.17 IC802.7 | IC801.207 40.4,97.07 v40.4,101.6 | v22.4,91.4 22.8,91 22.8,73.2 23.2,72.8 24.2,72.8 24.6,72.4 24.6,68.4 25.8,67.2 33.8,67.2 39,62 v39,59.6
  Bottom 0.15: v40.4,101.6 39.4,101.6 38.8,102.2 27.8,102.2 27.4,101.8 24.6,101.8 22.8,100 22.8,91.8 v22.4,91.4 | v39,59.6 43.6,59.6 44.4,58.8 50.2,58.8 51,59.6 56.6,59.6 57.2,59 60.4,59 60.6,58.8 v65.2,58.8
CTRL_IN_START  (via drill 0.3)
  Top 0.15: C1802.1 R1804.1 189.4,130.6 189.8,131 190.4,131 190.6,131.2 190.6,134.2 189.53,135.27 X1701.34 | S1802.2 S1802.4 | v193.8,126 193.8,112.6 v195.8,110.6
  Bottom 0.15: S1802.4 199.95,129.75 198.7,128.5 195,128.5 193.8,127.3 v193.8,126 | v195.8,110.6 196.8,111.6 204.8,111.6 209.08,107.32 IC1801.9 IC1801.8 | X1701.34 190.78,134 202,134 204.25,136.25 S1802.2
CTRL_IN_START_N  (via drill 0.3)
  Top 0.15: IC801.35 37.43,77.6 36.4,77.6 36,77.2 28.8,77.2 28.2,77.8 28.2,101.6 28.4,101.8 v28.4,110 | v48.3,110.2 48.3,111 48.2,111.1 48.2,124 51.6,127.4 v52.2,127.4 | v157.8,134 v157.8,127.4 | v187.8,124 187.8,120.1 188.4,119.5 192.2,119.5 192.6,119.1 192.6,110.8 193.6,109.8 203.6,109.8 v204.2,110.4
  Bottom 0.15: v28.4,110 40,110 40.2,110.2 v48.3,110.2 | v52.2,127.4 v157.8,127.4 | v157.8,134 187.6,134 188.2,133.4 188.2,128.2 186.9,126.9 186.9,125.6 187.8,124.7 v187.8,124 | IC1801.10 206.54,108.06 v204.2,110.4
CTRL_IN_STOP  (via drill 0.3)
  Top 0.15: S1801.2 v217.75,133.4 S1801.4 | v196.4,129.4 196.35,129.35 C1801.1 R1803.1 | v194.2,110.6 193.2,111.6 193.2,128.35 192.2,129.35 R1803.1 | 192,135.32 X1701.36 192.13,135.27 193.2,134.2 193.2,131.2 193,131 192.4,131 192,130.6 R1803.1
  Bottom 0.15: v196.4,129.4 198.6,129.4 202.6,133.4 v217.75,133.4 | v194.2,110.6 194.2,108.8 195,108 198.2,108 198.92,107.28 IC1801.13 IC1801.12
CTRL_IN_STOP_N  (via drill 0.3)
  Top 0.15: IC801.34 37.43,78.1 36.2,78.1 35.7,77.6 29.2,77.6 28.8,78 28.8,101.2 29,101.4 29,109.2 29.2,109.4 v29.2,110.6 | v47.6,110.8 47.6,124.4 51.2,128 v53,128 | v174.4,128 174.4,131.2 175.3,132.1 v175.3,137 | v199.1,136.5 v199.1,125 | v196.1,124 194.4,122.3 194.4,114.2 198,110.6 v201.4,110.6
  Bottom 0.15: v29.2,110.6 39.6,110.6 39.8,110.8 v47.6,110.8 | v53,128 v174.4,128 | v175.3,137 198.6,137 v199.1,136.5 | v199.1,125 198.1,124 v196.1,124 | IC1801.11 204,108 v201.4,110.6
CTRL_OUT_FAIL  (via drill 0.3)
  Top 0.15: IC801.58 42.3,66.77 42.3,65.9 42.2,65.8 42.2,64.9 42.4,64.7 42.4,59.6 v43.6,58.4 | v38.4,57.6 37.6,57.6 36.4,58.8 36.4,61.4 33,64.8 23.6,64.8 19.2,69.2 19.2,72.8 20.4,74 20.4,80 v20,80.4 | v30,81.4 30,100.6 30.2,100.8 30.2,108.8 30.8,109.4 v30.8,111.8 | v49.5,112 49.5,112.9 49.4,113 49.4,123.2 52.4,126.2 v52.8,126.2 | R1802.1 241.65,111.6 237.4,111.6 235.8,110 231.8,110 230,111.8 230,132.4 229.4,133 225.2,133 224.6,133.6 224.6,137.6 224.2,138 204.2,138 v203.8,138.4 | v160.4,138.4 v160.4,126.2 | v187,138.4 187,135.27 X1701.32
  Bottom 0.15: v43.6,58.4 42.8,57.6 v38.4,57.6 | v20,80.4 28.4,80.4 29.4,81.4 v30,81.4 | v30.8,111.8 39.2,111.8 39.4,112 v49.5,112 | v52.8,126.2 v160.4,126.2 | v160.4,138.4 v187,138.4 v203.8,138.4
CTRL_OUT_FAIL_LED
  Top 0.15: LED1802.A R1802.2
CTRL_OUT_PASS  (via drill 0.3)
  Top 0.15: IC801.57 41.8,66.77 41.8,64.2 41.9,64.1 41.9,58.9 v42.4,58.4 | v37.8,58.4 37,59.2 37,61.6 33.2,65.4 23.8,65.4 19.8,69.4 19.8,72.6 21,73.8 v21,79.8 | v29.4,80.4 29.4,100.8 29.6,101 29.6,109 30,109.4 v30,111.2 | v48.8,111.4 48.8,123.6 52,126.8 v53.6,126.8 | v162.8,137.8 v162.8,126.8 | X1701.30 184.43,137.17 184.4,137.4 v184.4,137.8 | v200.2,137.2 200.2,134.8 200.8,134.2 v204.2,134.2 | R1801.1 231.55,111.45 230.8,112.2 230.8,133.4 230,134.2 v225.6,134.2
  Bottom 0.15: v42.4,58.4 v37.8,58.4 | v21,79.8 28.8,79.8 v29.4,80.4 | v30,111.2 39.4,111.2 39.6,111.4 v48.8,111.4 | v53.6,126.8 v162.8,126.8 | v162.8,137.8 v184.4,137.8 199.6,137.8 v200.2,137.2 | v204.2,134.2 v225.6,134.2
CTRL_OUT_PASS_LED
  Top 0.15: LED1801.A R1801.2
DBG_3  (via drill 0.3)
  Top 0.15: IC801.43 37.43,73.6 v35.2,73.6 | X1702.8 51.8,133.96 51.8,132.2 50.8,131.2 49.2,131.2 44,126 44,107.2 45,106.2 45,105.4 v44.6,105 | v25.4,104.2 24.6,103.4 24.6,102.6 25.2,102 v25.2,74.2
  Bottom 0.15: v44.6,105 43.8,104.2 41.6,104.2 41.2,104.6 25.8,104.6 v25.4,104.2 | v25.2,74.2 34.6,74.2 v35.2,73.6
DBG_4  (via drill 0.3)
  Top 0.15: X1702.10 54.2,134.1 54.2,132.2 52.6,130.6 49.4,130.6 44.6,125.8 44.6,107.4 45.4,106.6 v45.4,104.4 | v25.4,103.2 25.4,102.6 25.8,102.2 25.8,68.2 26.2,67.8 34,67.8 39.6,62.2 v39.6,60.8 | v60.6,60.8 60.6,64.8 61.34,65.54 IC801.96
  Bottom 0.15: v45.4,104.4 44.4,103.4 41.4,103.4 40.8,104 26.2,104 v25.4,103.2 | v39.6,60.8 44,60.8 44.8,60 49.8,60 50.6,60.8 56.8,60.8 57.2,61.2 60.2,61.2 v60.6,60.8
DBG_5  (via drill 0.3)
  Top 0.15: IC801.40 37.53,75.2 38.6,75.2 38.9,75.5 v39.5,75.5 | X1702.12 56.8,134.04 56.8,132.2 54.6,130 49.6,130 45.2,125.6 45.2,107.4 46,106.6 v46,106 | v24.6,107 25.8,107 27.2,105.6 27.2,102.4 27,102.2 v27,75.8
  Bottom 0.15: v46,106 44.8,107.2 41.4,107.2 41.2,107 v24.6,107 | v39.5,75.5 38.5,75.5 37.2,76.8 35.4,76.8 34.6,76 28.2,76 28,75.8 v27,75.8
DBG_6  (via drill 0.3)
  Top 0.15: IC801.39 37.43,75.6 36.5,75.6 36.3,75.4 v35.8,75.4 | X1702.14 59.4,133.98 59.4,132.2 56.6,129.4 49.8,129.4 45.8,125.4 45.8,107.8 46.8,106.8 46.8,105.6 v46.2,105 | v26.4,103 v26.4,75
  Bottom 0.15: v46.2,105 46.2,104.2 44.8,102.8 41,102.8 40.4,103.4 26.8,103.4 v26.4,103 | v35.8,75.4 28.6,75.4 28.2,75 v26.4,75
DBG_10_LED
  Top 0.15: LED1702.C R1702.2
DBG_11_LED
  Top 0.15: LED1704.C R1704.2
DBG_12_LED
  Top 0.15: LED1706.C R1706.2
DBG_13_LED
  Top 0.15: LED1708.C R1708.2
DBG_80
  Top 0.15: IC801.80 53.34,68.96 53.2,69.1 53.2,74.85 TP1003.1
DBG_81
  Top 0.15: IC801.97 61.8,66.85 61.8,67.9 61.6,68.1 61.6,68.81 TP1001.1
DCL_1
  Top 0.15: IC2001.3 22.26,54.94 22.6,54.6 22.6,50.2 22.26,49.86 IC2001.5
DCL_OUT  (via drill 0.3)
  Top 0.15: IC801.3 31.54,93.66 30.8,94.4 30.8,108.6 31.4,109.2 v31.4,127.2 | v22.4,128 16.2,128 16,128.2 v13.6,128.2
  Bottom 0.15: IC2001.4 18.6,52.4 18,51.8 18,47.4 16.6,46 16,46 10,52 10,59.6 9.2,60.4 9.2,65.4 8.8,65.8 8.8,95.2 8.2,95.8 6.8,95.8 6.2,96.4 6.2,98.8 13,105.6 13,117.4 13.6,118 v13.6,128.2 | v31.4,127.2 30.6,128 v22.4,128
DEBUG_0  (via drill 0.3)
  Top 0.15: IC801.61 43.9,66.87 43.9,67.8 44.1,68.1 44.1,69.1 v43.8,69.4 | R1701.1 v17.2,70 | v20.4,70 v22.8,70 | X1702.2 44.2,133.94 44.2,132.2 42.2,130.2 42.2,106.2 v42.6,105.8 | v24.6,105.8 24.6,105.2 23.4,104 23.4,101.8 24,101.2 24,74 25.2,72.8 v25.2,70
  Bottom 0.15: v17.2,70 v20.4,70 | v42.6,105.8 v24.6,105.8 | v22.8,70 v25.2,70 30.8,70 31.8,68.8 35.6,68.8 38.2,70 43.6,70 43.8,69.8 v43.8,69.4
DEBUG_1  (via drill 0.3)
  Top 0.15: IC801.33 37.43,78.6 36,78.6 35.4,78 29.8,78 29.5,78.3 v29.5,79.2 | R1703.1 16.8,75 v17.4,75 | X1702.4 46.6,134.08 46.6,132.2 42.8,128.4 42.8,106.6 43.4,106 v43.4,105 | v25.4,105.2 24,103.8 24,102.2 24.6,101.6 v24.6,79.2
  Bottom 0.15: v43.4,105 41.8,105 41.6,105.2 v25.4,105.2 | v29.5,79.2 v24.6,79.2 17.8,79.2 17.4,78.8 v17.4,75
DEBUG_2  (via drill 0.3)
  Top 0.15: IC801.44 37.53,73.2 v39.8,73.2 | R1705.1 17,78 v18,77 | X1702.6 49.2,134.02 49.2,132 43.4,126.2 43.4,106.8 v44.2,106 | v25.3,106.4 23.6,106.4 22.8,105.6 22.8,101.4 23.4,100.8 v23.4,78.4 v23.4,73.6
  Bottom 0.15: v44.2,106 43.6,106.6 41.6,106.6 41.4,106.4 v25.3,106.4 | v23.4,78.4 18.2,78.4 18,78.2 v18,77 | v23.4,73.6 34.3,73.6 35,72.8 36.7,72.8 37.1,73.2 v39.8,73.2
DEBUG_3  (via drill 0.3)
  Top 0.15: IC801.37 37.53,76.7 38.6,76.7 38.8,76.9 v39.5,76.9 | X1702.16 62,133.92 62,132.2 58.6,128.8 50,128.8 46.4,125.2 46.4,108 47.4,107 47.4,104.8 v47,104.4 | v25.3,107.6 26,107.6 27.8,105.8 27.8,102.2 27.6,102 v27.6,76.6
  Bottom 0.15: v47,104.4 47,106 45.2,107.8 41.2,107.8 41,107.6 v25.3,107.6 | v27.6,76.6 34.4,76.6 35.2,77.4 37.4,77.4 37.9,76.9 v39.5,76.9
DEBUG_4  (via drill 0.3)
  Top 0.15: IC801.149 67.73,91.2 68.7,91.2 v69.2,91.35 | v74,92.4 74,91.6 v73.6,91.2
  Bottom 0.15: v69.2,91.35 70.05,91.35 70.2,91.2 v73.6,91.2 | TP603.1 74,98 74.2,97.8 74.2,93.2 74,93 v74,92.4
DEBUG_5  (via drill 0.3)
  Top 0.15: IC801.150 67.63,91.6 66.7,91.6 66.5,91.4 v64.7,91.4
  Bottom 0.15: v64.7,91.4 67.4,91.4 67.6,91.6 67.6,93 70.8,96.2 TP602.1
DEBUG_6
  Top 0.15: IC801.152 67.73,92.7 68.6,92.7 68.7,92.8 69.2,92.8 69.7,92.3 73.3,92.3 73.4,92.4 73.4,93.4 74,94 74,99.6 73.8,99.8 TP601.1
DEBUG_10  (via drill 0.3)
  Top 0.15: X1702.32 82.4,133.84 v82.4,120.8 | IC1201.143 188.4,79.35 188.4,80.4 186.4,82.4 v186.4,87.6 | v186.8,89.8 v186.8,116.6
  Bottom 0.15: v82.4,120.8 163.6,120.8 164.8,119.6 172.2,119.6 175.2,116.6 v186.8,116.6 | v186.4,87.6 186.8,88 v186.8,89.8
DEBUG_11  (via drill 0.3)
  Top 0.15: IC1201.142 188.8,79.25 188.8,78.6 188.6,78.4 188.6,77.6 188.9,77.3 v189.3,77.3 | v191,83 191,84.4 v187.8,87.6 | v187.4,115.8 187.4,93.4 187.8,93 TP1701.1 | X1701.14 165.2,134.18 165.2,132 164.4,131.2 v164.4,127 | v174.4,127 174.4,124.8 174.6,124.6 175.4,124.6 177,123 v177,114.4
  Bottom 0.15: v189.3,77.3 189.4,77.4 190.8,77.4 191.6,78.2 191.6,82.4 v191,83 | v187.8,87.6 TP1701.1 | v164.4,127 v174.4,127 | v177,114.4 180.4,114.4 181.8,115.8 v187.4,115.8
DEBUG_12  (via drill 0.3)
  Top 0.15: X1702.28 77.2,133.96 v77.2,120.8 | IC1201.34 178.65,60.85 v177.8,60 | v178.2,115 179,114.2 179,83.2 v176.6,80.8
  Bottom 0.15: v77.2,120.8 78.4,119.6 163.2,119.6 164.4,118.4 171.6,118.4 175,115 v178.2,115 | v176.6,80.8 174.6,80.8 173.4,79.6 173.4,60.4 173.8,60 v177.8,60
DEBUG_13  (via drill 0.3)
  Top 0.15: X1702.30 79.8,133.9 v79.8,120.8 | IC1201.33 178.15,61.35 v177.8,61 | v178.8,115.8 179.6,115 179.6,82.8 v177.6,80.8
  Bottom 0.15: v79.8,120.8 80.4,120.2 163.4,120.2 164.6,119 172,119 175.2,115.8 v178.8,115.8 | v177.6,80.8 177,80.2 174.8,80.2 174,79.4 174,61.4 174.4,61 v177.8,61
DEBUG_14  (via drill 0.3)
  Top 0.15: X1702.26 74.6,134.02 v74.6,121.4 | IC1201.38 188.4,57.95 188.4,58.7 188.5,58.9 188.5,62.5 189.8,63.8 v189.8,69.2 | v177.4,76 177.4,76.6 177.2,76.8 177.2,79.2 180.2,82.2 180.2,117.4 180,117.6 v179.2,117.6 | v60.4,121.4 v60.4,124.4 | v21.4,128.6 v17,128.6 | v9.8,61.4 17.6,61.4 18.98,60.02 IC2001.1
  Bottom 0.15: v189.8,69.2 189.4,68.8 182.4,68.8 177.4,73.8 v177.4,76 | v179.2,117.6 175,117.6 172.4,120.2 165,120.2 163.8,121.4 v74.6,121.4 v60.4,121.4 | v60.4,124.4 59.4,125.4 52.4,125.4 51.2,126.6 33,126.6 31,128.6 v21.4,128.6 | v17,128.6 17,122.2 15.4,120.6 14.6,120.6 14.2,120.2 14.2,104.2 14,104 12.2,104 8.8,100.6 8.8,97.6 9.4,97 9.4,66 9.8,65.6 v9.8,61.4
DEBUG_15  (via drill 0.3)
  Top 0.15: X1702.24 72.2,133.88 72.2,131.6 67,126.4 56.6,126.4 56.2,126 56.2,125.4 54.4,123.6 53.2,123.6 51.8,122.2 51.8,116 52.4,115.4 v52.4,113.2 | v16,59.6 16,58.05 R1708.1 18,58 18.52,57.48 IC2001.2 | v180,118.4 180.8,117.6 180.8,82 177.8,79 v177.8,77.4 | IC1201.39 188.9,57.95 188.9,58.6 189,58.8 189,62.2 190.4,63.6 v190.4,68.2
  Bottom 0.15: v16,59.6 12.6,59.6 12.4,59.8 12.4,66.2 11.8,66.8 11.8,100.2 13.2,101.6 19,101.6 20.8,103.4 22.2,103.4 22.6,103.8 22.6,109 24.2,110.6 27,110.6 29.6,113.2 v52.4,113.2 53.2,114 53.2,115 60.2,122 164,122 165.2,120.8 172.6,120.8 175,118.4 v180,118.4 | v190.4,68.2 182.2,68.2 177.6,72.8 177.2,72.8 176.2,73.8 176.2,76.4 177.2,77.4 v177.8,77.4
DEBUG_16  (via drill 0.3)
  Top 0.15: X1702.22 69.6,133.94 69.6,131.6 65,127 56.4,127 55.6,126.2 55.6,125.6 54.2,124.2 52.8,124.2 51.2,122.6 51.2,115.8 51.6,115.4 v51.6,113.8 | v16,55.4 16,54.05 R1706.1 17.4,54 18,53.4 18,47.8 18.48,47.32 IC2001.6 | v180.8,119 181.4,118.4 181.4,81.8 178.4,78.8 v178.4,76.6 | IC1201.40 189.4,57.95 189.4,61.8 191,63.4 v191,69.2
  Bottom 0.15: v16,55.4 12,55.4 11.8,55.6 11.8,66 11.2,66.6 11.2,100.4 13,102.2 18.8,102.2 20.6,104 21.8,104 22,104.2 22,109.2 24,111.2 26.8,111.2 29.4,113.8 v51.6,113.8 52.6,114.8 52.6,115.2 60,122.6 164.2,122.6 165.4,121.4 172.8,121.4 175.2,119 v180.8,119 | v191,69.2 190.4,69.8 189.2,69.8 188.8,69.4 182.6,69.4 178.4,73.6 v178.4,76.6
DEBUG_17  (via drill 0.3)
  Top 0.15: X1702.20 67,134 67,131.8 62.8,127.6 56,127.6 55,126.6 55,125.8 54,124.8 52.6,124.8 50.6,122.8 50.6,115.6 50.8,115.4 v50.8,114.4 | v16,51.4 16,50.05 R1704.1 17.2,50 17.4,49.8 17.4,46.6 18,46 21.4,46 22.72,47.32 IC2001.9 | v181.6,119.6 182,119.2 182,81.6 179,78.6 v179,78 | IC1201.41 189.8,57.95 189.8,61.4 191.6,63.2 v191.6,68.2
  Bottom 0.15: v16,51.4 13,51.4 11.2,53.2 11.2,65.8 10.6,66.4 10.6,100.6 12.8,102.8 18.6,102.8 20.4,104.6 21.2,104.6 21.4,104.8 21.4,109.4 23.8,111.8 26.6,111.8 29.2,114.4 v50.8,114.4 51.4,114.4 52,115 52,115.4 59.8,123.2 164.4,123.2 165.6,122 173,122 175.4,119.6 v181.6,119.6 | v191.6,68.2 191,67.6 182,67.6 177.4,72.2 177,72.2 175.6,73.6 175.6,76.8 176.8,78 v179,78
DEBUG_18  (via drill 0.3)
  Top 0.15: X1702.18 64.4,134.06 64.4,131.6 61,128.2 55.6,128.2 54.4,127 54.4,126 53.8,125.4 52.4,125.4 50,123 v50,115 | R1702.1 16,46.05 v16,47.4 | v182.4,120.2 182.4,119.6 182.6,119.4 182.6,81.4 179.6,78.4 v179.6,77.2 | IC1201.42 190.4,57.95 190.4,61.2 192.2,63 v192.2,69.2 | IC2001.12 IC2001.13 26.52,57.48 26.2,57.8 26.2,58.8 22.6,62.4 v10.6,62.4
  Bottom 0.15: v16,47.4 10.6,52.8 v10.6,62.4 10.6,65.6 10,66.2 10,97.2 9.4,97.8 9.4,100.4 12.4,103.4 18.2,103.4 19.2,104.4 19.2,110.6 20,111.4 22.6,111.4 23.6,112.4 26.4,112.4 29,115 v50,115 50.8,115 59.6,123.8 164.6,123.8 165.8,122.6 173.2,122.6 175.6,120.2 v182.4,120.2 | v192.2,69.2 191,70.4 189,70.4 188.6,70 183,70 179.6,73.4 v179.6,77.2
DGB_0_LED
  Top 0.15: LED1701.C R1701.2
DGB_1_LED
  Top 0.15: LED1703.C R1703.2
DGB_2_LED
  Top 0.15: LED1705.C R1705.2
DISP_1_COM
  Bottom 0.15: 136.96,59.8 J1901.2
  Bottom 0.3: J1902.2 J1901.2 | DIS1901.4 137.66,56.14 137.2,56.6 135.6,56.6 135.2,57 135.2,59.4 135.6,59.8 136.96,59.8
DISP_1_SEG_A  (via drill 0.3)
  Top 0.15: IC1201.7 186.55,74.35 186.6,74.4 187.4,74.4 188.4,75.4 v192,75.4 | v192.8,84.2 192.8,85.8 192.6,86 v192.6,87.8
  Bottom 0.15: v192,75.4 193.2,76.6 193.2,83.6 v192.8,84.2 | v192.6,87.8 192.6,90.2 190.4,92.4 186,92.4 184.8,91.2 184.8,88.4 181.4,85 174,85 173,86 173,93.2 172.31,93.89 RN1901.1
DISP_1_SEG_A_R
  Bottom 0.15: RN1901.2 166.95,91.35 166.4,90.8 166.4,83.2 166,82.8 162,82.8 160,80.8 160,76.8 159.8,76.6 133.2,76.6 129,72.4 129,69.4 130,68.4 134.6,68.4 135.12,68.92 DIS1901.16
DISP_1_SEG_B  (via drill 0.3)
  Top 0.15: IC1201.6 186.85,74.85 188,76 191.6,76 v192,76.4 | v191.8,84.2 191.8,85.6 191.6,85.8 v191.6,87.8
  Bottom 0.15: v192,76.4 192.6,77 192.6,83.4 v191.8,84.2 | v191.6,87.8 191.6,90.4 190.2,91.8 186.2,91.8 185.4,91 185.4,88 181.8,84.4 173.8,84.4 172.4,85.8 172.4,88.2 171.79,88.81 RN1901.3
DISP_1_SEG_B_R  (via drill 0.3)
  Top 0.15: v140.4,76 140.4,72 140.2,71.8 DIS1901.14
  Bottom 0.15: RN1901.4 167.47,86.27 167,85.8 167,82.8 166.4,82.2 162.4,82.2 160.6,80.4 160.6,76.2 160.4,76 v140.4,76
DISP_1_SEG_C  (via drill 0.3)
  Top 0.15: IC1201.4 185.95,75.8 187,75.8 187.8,76.6 191,76.6 v192,77.6
  Bottom 0.15: v192,77.6 192,83 190.8,84.2 185.6,84.2 185.2,83.8 171.2,83.8 171.13,83.73 RN1901.5
DISP_1_SEG_C_R  (via drill 0.3)
  Top 0.15: v136.4,73.4 134,71 134,64.4 130.04,60.44 DIS1901.1
  Bottom 0.15: RN1901.6 167.39,81.19 166.2,80 166.2,75 165.4,74.2 137.2,74.2 v136.4,73.4
DISP_1_SEG_D  (via drill 0.3)
  Top 0.15: IC1201.2 185.95,76.8 187.2,76.8 187.6,77.2 187.6,77.6 185.6,79.6 v185.6,83.2
  Bottom 0.15: v185.6,83.2 173.8,83.2 171,80.4 171,79 170.65,78.65 RN1901.7
DISP_1_SEG_D_R  (via drill 0.3)
  Top 0.15: v136.4,72.2 136.4,65.6 135.12,64.32 DIS1901.3
  Bottom 0.15: RN1901.8 169,74.2 168.4,73.6 137.8,73.6 v136.4,72.2
DISP_1_SEG_E
  Top 0.15: IC1201.3 185.85,76.4 184.8,76.4 184.4,76 178.4,76 177.8,75.4 176.8,75.4 175,77.2 175,92 174.4,92.6 166.6,92.6 165.31,93.89 RN1902.1
DISP_1_SEG_E_R  (via drill 0.3)
  Top 0.15: v155.4,77.8 155.4,72.8 154.6,72 142.4,72 141.4,71 141.4,68 136.4,63 136.4,53.8 136,53.4 133.2,53.4 132.58,54.02 DIS1901.2
  Bottom 0.15: RN1902.2 162.15,91.35 161.6,90.8 161.6,84.2 158.8,81.4 158.8,78.2 158.4,77.8 v155.4,77.8
DISP_1_SEG_F
  Top 0.15: IC1201.5 185.85,75.4 185,75.4 184.8,75.6 178.8,75.6 178,74.8 176.6,74.8 174.4,77 174.4,86.8 173.4,87.8 166.4,87.8 165.39,88.81 RN1902.3
DISP_1_SEG_F_R
  Bottom 0.15: RN1902.4 162.47,86.27 162.2,86 162.2,84 159.4,81.2 159.4,77.4 159.2,77.2 132.8,77.2 128.4,72.8 128.4,69 129.6,67.8 137,67.8 137.66,68.46 DIS1901.15
DISP_1_SEG_G
  Top 0.15: IC1201.23 185.85,66.4 174.6,66.4 171,62.8 162.8,62.8 162.6,63 162.6,65.2 165.8,68.4 165.8,73.2 167,74.4 167,82.2 165.47,83.73 RN1902.5
DISP_1_SEG_G_R
  Bottom 0.15: RN1902.6 162.19,81.19 161.2,80.2 161.2,75.6 161,75.4 133.2,75.4 132.6,74.8 132.6,70.24 DIS1901.17
DISP_1_SEG_H
  Top 0.15: IC1201.25 185.85,65.4 185.2,65.4 184.6,66 175,66 171.2,62.2 162.4,62.2 162,62.6 162,65.6 165.2,68.8 165.2,73.4 166.4,74.6 166.4,78.2 165.95,78.65 RN1902.7
DISP_1_SEG_H_R
  Bottom 0.15: RN1902.8 162.11,76.11 161.8,75.8 161.8,75 161.6,74.8 134.4,74.8 134,74.4 134,69.6 133.4,69 131.26,69 DIS1901.18
DISP_2_COM
  Bottom 0.3: J1904.1 J1903.1 142.64,59.76 143,59.4 143,57 142.6,56.6 140.8,56.6 140.2,56 DIS1901.5
DISP_2_SEG_A
  Top 0.15: IC1201.26 185.85,64.8 185.2,64.8 184.4,65.6 175.4,65.6 171.4,61.6 162.2,61.6 161.4,62.4 161.4,67.6 161.05,67.95 RN1903.2
DISP_2_SEG_A_R
  Bottom 0.15: RN1903.1 158.09,70.49 156.4,68.8 149.24,68.8 DIS1901.11
DISP_2_SEG_B
  Top 0.15: IC1201.28 185.85,63.9 184.3,63.9 184.2,63.8 184.2,63 183.9,62.7 182.8,62.7 182.7,62.8 173.4,62.8 171.6,61 162,61 161.2,61.8 160,61.8 159.6,62.2 RN1903.4
DISP_2_SEG_B_R
  Bottom 0.15: RN1903.3 143.59,65.41 142.8,66.2 142.8,70.16 DIS1901.13
DISP_2_SEG_C  (via drill 0.3)
  Top 0.15: IC1201.24 185.95,65.8 188.9,65.8 189.3,65.4 189.3,64.1 188,62.8 188,60 186.6,58.6 184.6,58.6 183.4,59.8 179.8,59.8 v177.8,57.8 | v175.8,57.8 173.2,60.4 162.6,60.4 162.2,60 162.2,58.2 161.79,57.79 RN1903.6
  Bottom 0.15: v177.8,57.8 v175.8,57.8
DISP_2_SEG_C_R